# Altium project ADAS_ECU_revB.PrjPcb (part 3 of 3)

## Sheet LM74910H_PINOUT.SchDoc
size B; SheetNumber: 11; SheetTotal: 18
Used 2 times, as channels OR_0, OR_1. Parts and nets are listed once, with the designators drawn on the sheet.
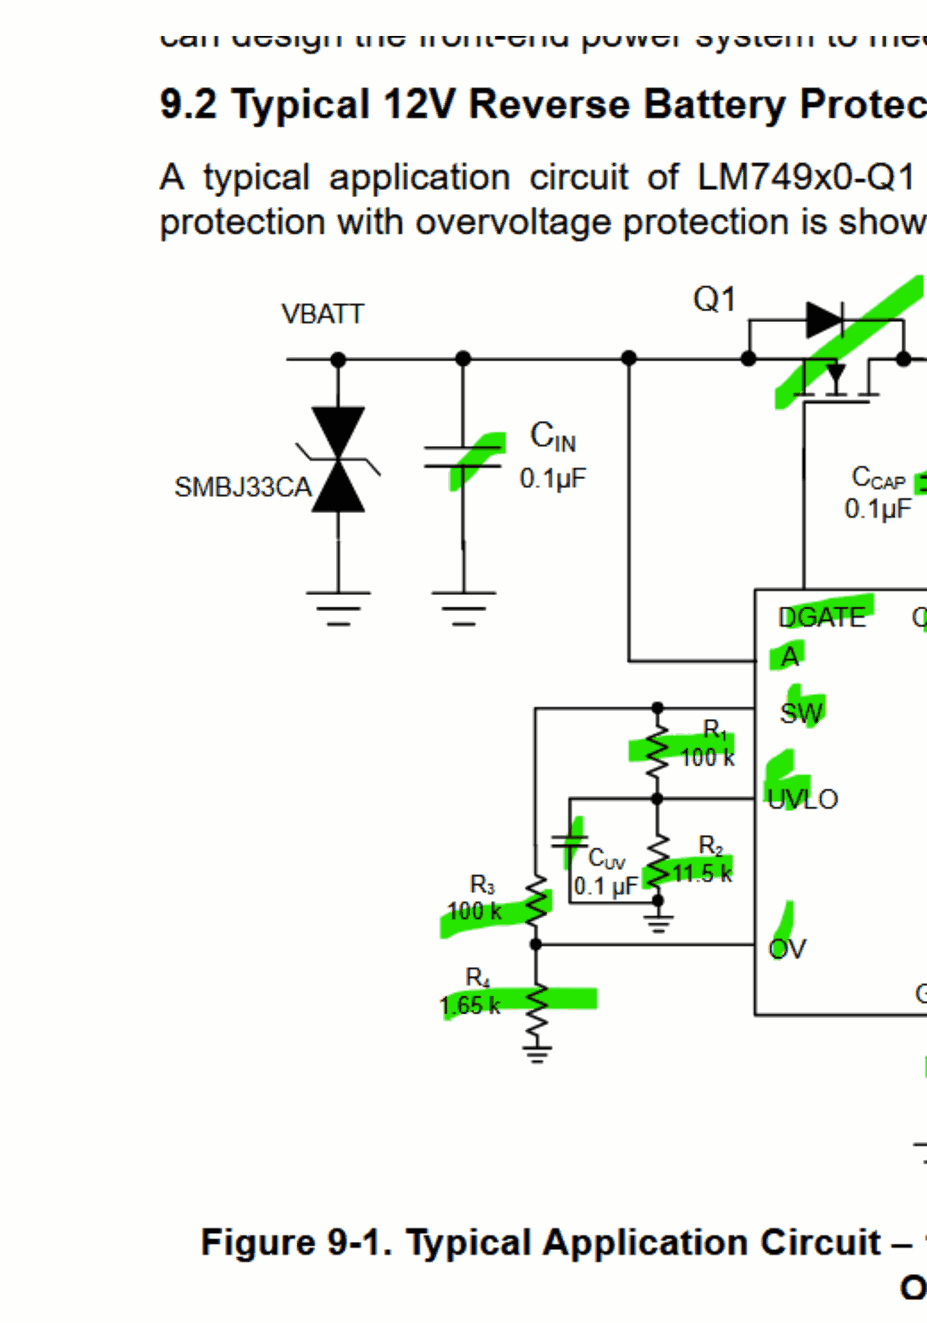
[diagram p23: LM74910H_PINOUT.SchDoc, top left]
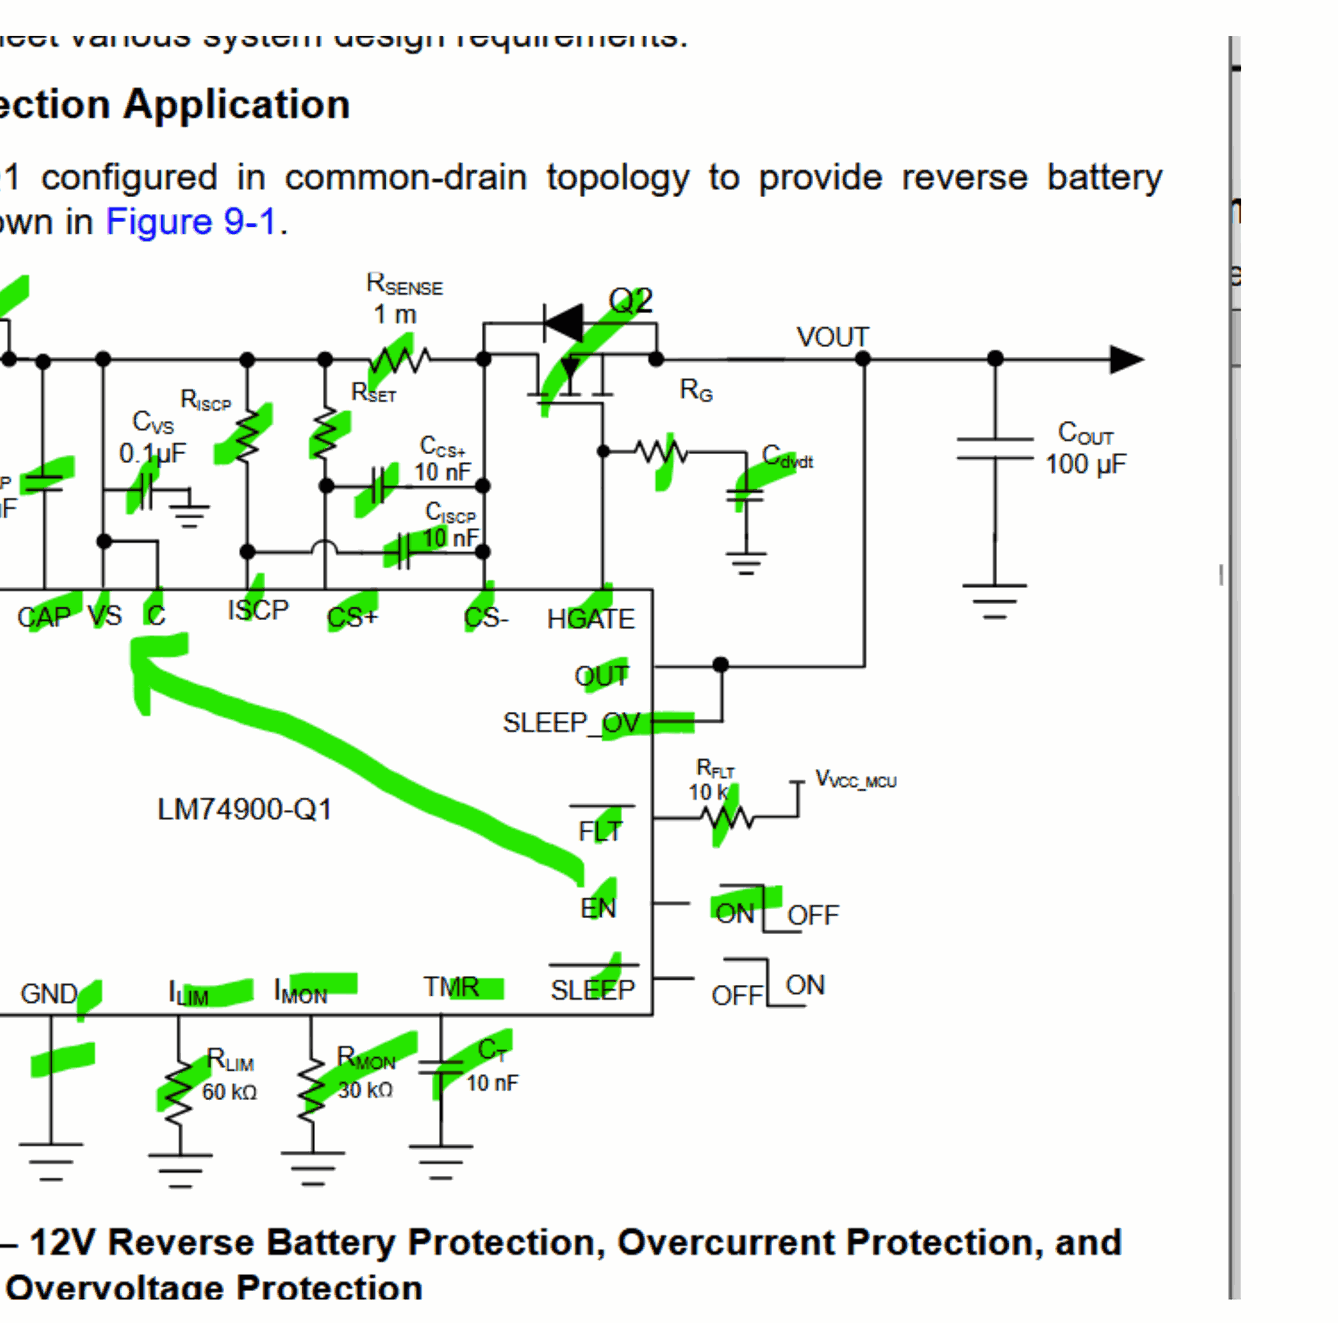
[diagram p24: LM74910H_PINOUT.SchDoc, top right]
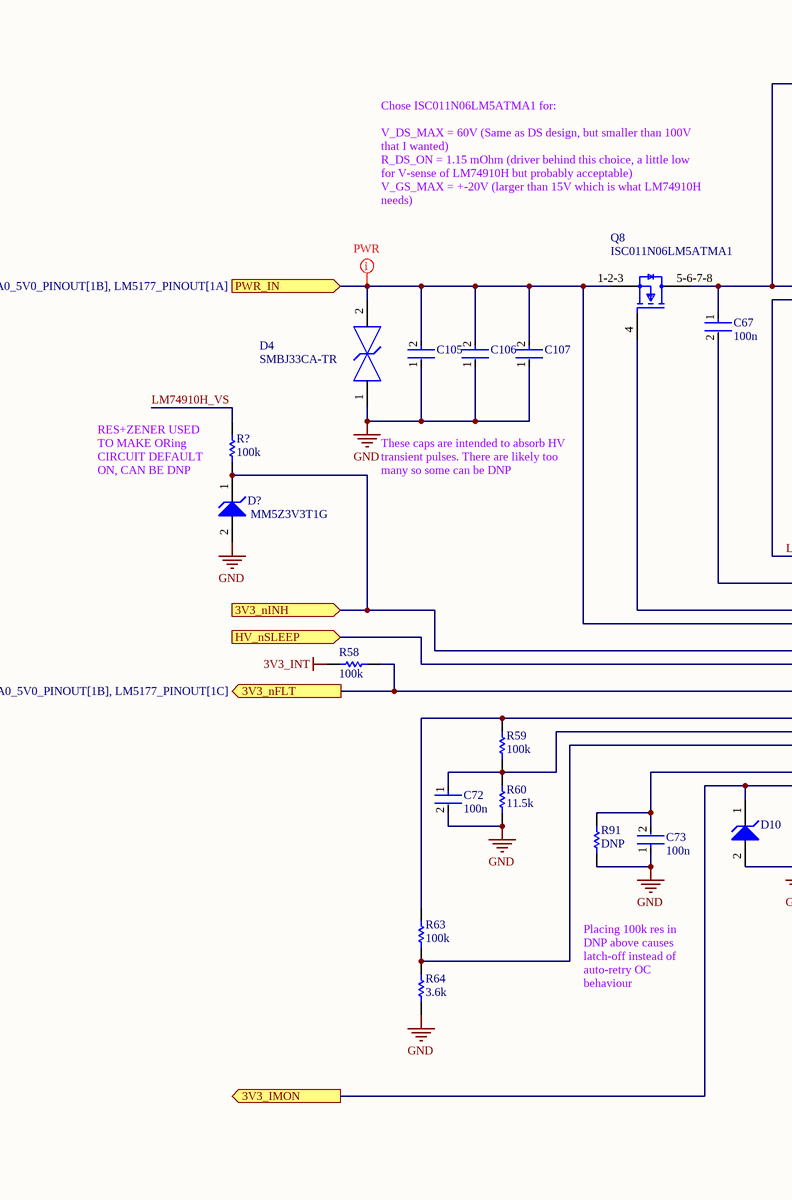
[diagram p25: LM74910H_PINOUT.SchDoc, bottom left]
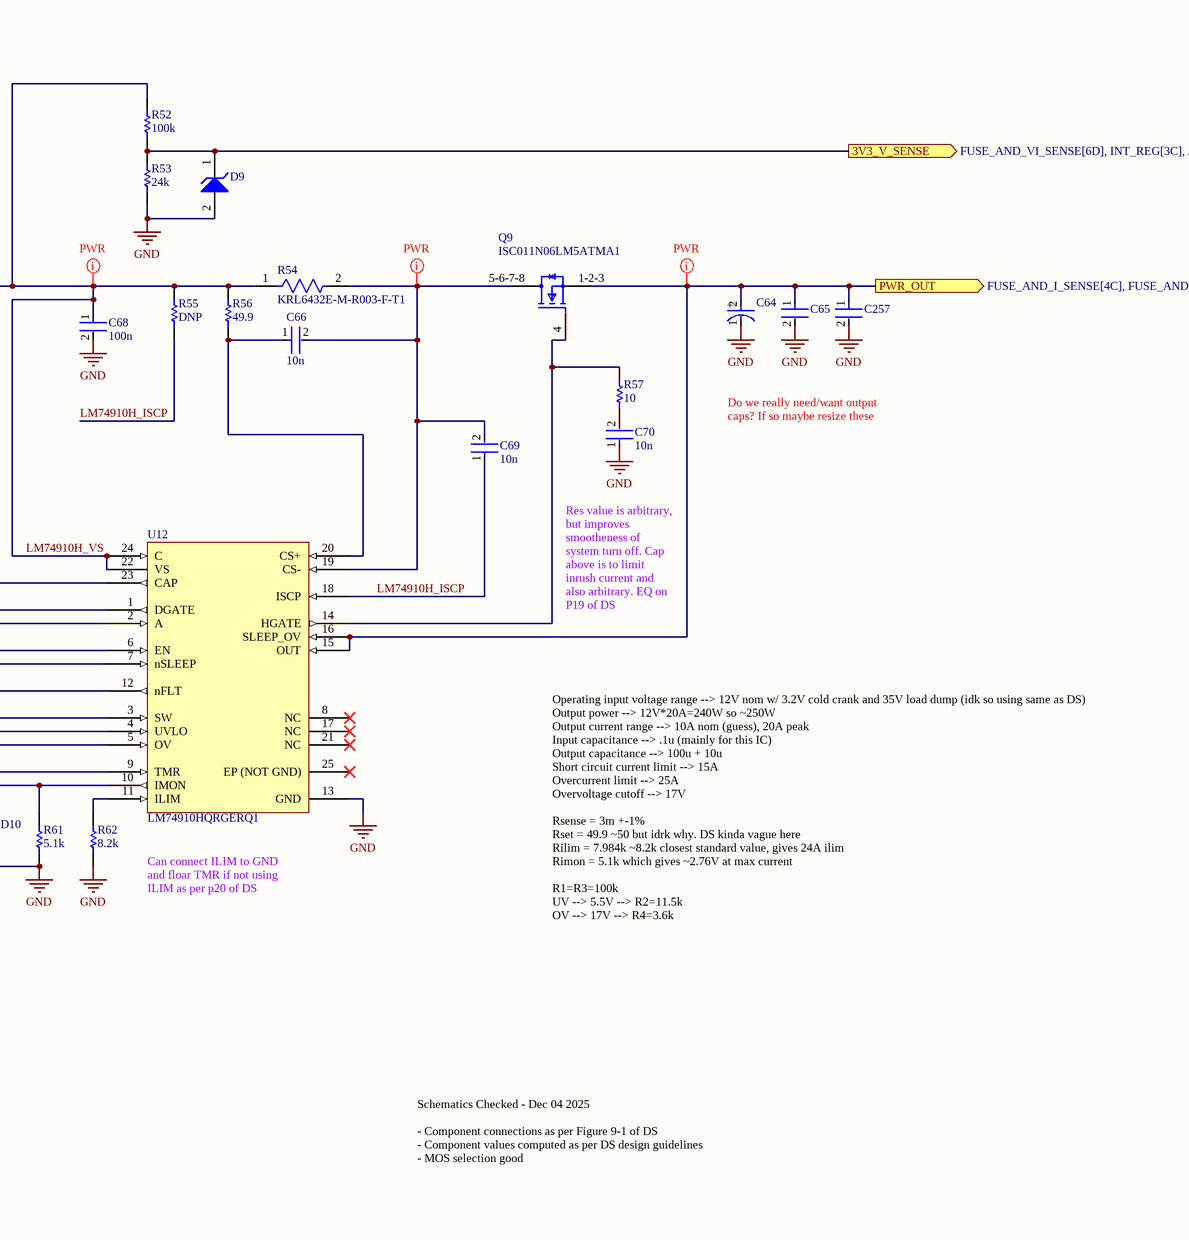
[diagram p26: LM74910H_PINOUT.SchDoc, bottom right]

### Parts
C64  EEE-FK1H100UR  [FP-FKC-MFG]  (value not drawn)
C65  12103D106KAT2A  [FP-1210-L_3_3_0_4-W_2_5_0-MFG]  (value not drawn)
C66  10n  [FP-0402-L_1_0_0_05-W_0_5-IPC_A]
C67  100n  [FP-0402-L_1_0_0_05-W_0_5-IPC_A]
C68  100n  [FP-0402-L_1_0_0_05-W_0_5-IPC_A]
C69  10n  [FP-0402-L_1_0_0_05-W_0_5-IPC_A]
C70  10n  [FP-0402-L_1_0_0_05-W_0_5-IPC_A]
C72  100n  [FP-0402-L_1_0_0_05-W_0_5-IPC_A]
C73  100n  [FP-0402-L_1_0_0_05-W_0_5-IPC_A]
C105  AC1210KKX7R0BB104  [FP-AC1210-0_85-MFG]  (value not drawn)
C106  AC1210KKX7R0BB104  [FP-AC1210-0_85-MFG]  (value not drawn)
C107  AC1210KKX7R0BB104  [FP-AC1210-0_85-MFG]  (value not drawn)
C257  12103D106KAT2A  [FP-1210-L_3_3_0_4-W_2_5_0-MFG]  (value not drawn)
D4  SMBJ33CA-TR  [FP-SMB-CA-MFG]
D9  DNP/MM5Z3V3T1G  [ONSC-SOD-523-2-502-01_V]  (value not drawn)
D10  DNP/MM5Z3V3T1G  [ONSC-SOD-523-2-502-01_V]  (value not drawn)
D?  MM5Z3V3T1G  [ONSC-SOD-523-2-502-01_V]
Q8  ISC011N06LM5ATMA1  [FP-PG-TDSON-8-MFG]
Q9  ISC011N06LM5ATMA1  [FP-PG-TDSON-8-MFG]
R52  100k  [R0603B]
R53  24k  [R0603B]
R54  KRL6432E-M-R003-F-T1  [FP-KRL6432E-MFG]
R55  DNP  [R0603B]
R56  49.9  [R0603B]
R57  10  [R0603B]
R58  100k  [R0603B]
R59  100k  [R0603B]
R60  11.5k  [R0603B]
R61  5.1k  [R0603B]
R62  8.2k  [R0603B]
R63  100k  [R0603B]
R64  3.6k  [R0603B]
R91  DNP  [R0603B]
R?  100k  [R0603B]
U12  LM74910HQRGERQ1  [QFN50P400X400X100_HS-25N]

### Ports
3V3_IMON (out), 3V3_nFLT (out, see LM704A0_3V3_PINOUT[1B], LM704A0_5V0_PINOUT[1B], LM5177_PINOUT[1C]), 3V3_nINH (in), 3V3_V_SENSE (out, see FUSE_AND_VI_SENSE[6D], INT_REG[3C], JETSON_PWR_MUX[5B], LM704A0_3V3_PINOUT[6B], LM704A0_5V0_PINOUT[6B], LM5177_PINOUT[6A]), HV_nSLEEP (in), PWR_IN (in, see FUSE_AND_I_SENSE[1B], FUSE_AND_VI_SENSE[1B], INT_REG[2A], LM704A0_3V3_PINOUT[2B], LM704A0_5V0_PINOUT[1B], LM5177_PINOUT[1A]), PWR_OUT (out, see FUSE_AND_I_SENSE[4C], FUSE_AND_VI_SENSE[6C], JETSON_PWR_MUX[5A], LM704A0_3V3_PINOUT[6B], LM704A0_5V0_PINOUT[6B], LM5177_PINOUT[6A])

### Nets
3V3_INT: R58.2
GND: C64.1(C) C65.2 C68.2 C70.1 C72.2 C73.1 C105.1 C106.1 C107.1 C257.2 D4.1 D9.2(A) D10.2(A) D?.2(A) R53.1 R60.1 R61.1 R62.1 R64.1 R91.1 U12.13(GND)
3V3_IMON: D10.1(K) R61.2 U12.10(IMON) ; port 3V3_IMON
3V3_nFLT: R58.1 U12.12(nFLT) ; port 3V3_nFLT
3V3_nINH: D?.1(K) R?.1 U12.6(EN) ; port 3V3_nINH
3V3_V_SENSE: D9.1(K) R52.1 R53.2 ; port 3V3_V_SENSE
HV_nSLEEP: U12.7(nSLEEP) ; port HV_nSLEEP
LM74910H_ISCP: C69.1 R55.1 U12.18(ISCP)
LM74910H_VS: C67.1 C68.1 Q8.5-6-7-8(D) R52.2 R54.1 R55.2 R56.2 R?.2 U12.22(VS) U12.24(C)
PWR_IN: C105.2 C106.2 C107.2 D4.2 Q8.1-2-3(S) U12.2(A) ; port PWR_IN
PWR_OUT: C64.2(A) C65.1 C257.1 Q9.1-2-3(S) U12.15(OUT) U12.16(SLEEP_OV) ; port PWR_OUT
NetC66_1: C66.1 R56.1 U12.20(CS+)
NetC66_2: C66.2 C69.2 Q9.5-6-7-8(D) R54.2 U12.19(CS-)
NetC67_2: C67.2 U12.23(CAP)
NetC70_2: C70.2 R57.1
NetC72_1: C72.1 R59.1 R60.2 U12.4(UVLO)
NetC73_2: C73.2 R91.2 U12.9(TMR)
NetQ8_4: Q8.4(G) U12.1(DGATE)
NetQ9_4: Q9.4(G) R57.2 U12.14(HGATE)
NetR59_2: R59.2 R63.2 U12.3(SW)
NetR62_2: R62.2 U12.11(ILIM)
NetR63_1: R63.1 R64.2 U12.5(OV)

Not connected (* = marked no-connect by the designer): U12 8(NC)* 17(NC)* 21(NC)* 25(EP_(NOT_GND))*

### Channels
OR_0: designators end in _OR_0; ports 3V3_IMON=3V3_CAR_VCC_I_SENSE 3V3_nFLT=3V3_CAR_OR_nFLT 3V3_nINH=NetD?_OR_0_1 3V3_V_SENSE=3V3_CAR_VCC_V_SENSE HV_nSLEEP=HV_PWR_EN PWR_IN=CAR_VCC PWR_OUT=PRE_VCC
OR_1: designators end in _OR_1; ports 3V3_IMON=3V3_CAR_APM_I_SENSE 3V3_nFLT=3V3_APM_OR_nFLT 3V3_nINH=NetD?_OR_1_1 3V3_V_SENSE=3V3_CAR_APM_V_SENSE HV_nSLEEP=HV_PWR_EN PWR_IN=APM_VCC PWR_OUT=PRE_VCC

### Layout directives
net class PWR: CAR_VCC, LM74910H_VS_OR_0, NetC66_OR_0_2, PRE_VCC

### Notes on the sheet
- Chose ISC011N06LM5ATMA1 for:
  V_DS_MAX = 60V (Same as DS design, but smaller than 100V that I wanted)
  R_DS_ON = 1.15 mOhm (driver behind this choice, a little low for V-sense of LM74910H but probably acceptable)
  V_GS_MAX = +-20V (larger than 15V which is what LM74910H needs)
- RES+ZENER USED TO MAKE ORing CIRCUIT DEFAULT ON, CAN BE DNP
- These caps are intended to absorb HV transient pulses. There are likely too many so some can be DNP
- Do we really need/want output caps? If so maybe resize these
- Res value is arbitrary, but improves smootheness of system turn off. Cap above is to limit inrush current and also arbitrary. EQ on P19 of DS
- Can connect ILIM to GND and floar TMR if not using ILIM as per p20 of DS
- Placing 100k res in DNP above causes latch-off instead of auto-retry OC behaviour
- Operating input voltage range --> 12V nom w/ 3.2V cold crank and 35V load dump (idk so using same as DS)
  Output power --> 12V*20A=240W so ~250W
  Output current range --> 10A nom (guess), 20A peak
  Input capacitance --> .1u (mainly for this IC)
  Output capacitance --> 100u + 10u
  Short circuit current limit --> 15A
  Overcurrent limit --> 25A
  Overvoltage cutoff --> 17V
  Rsense = 3m +-1%
  Rset = 49.9 ~50 but idrk why. DS kinda vague here
  Rilim = 7.984k ~8.2k closest standard value, gives 24A ilim
  Rimon = 5.1k which gives ~2.76V at max current
  R1=R3=100k
  UV --> 5.5V --> R2=11.5k
  OV --> 17V --> R4=3.6k
- Schematics Checked - Dec 04 2025
  - Component connections as per Figure 9-1 of DS
  - Component values computed as per DS design guidelines
  - MOS selection good
- (in symbol CMP-05427-000030-1) +

### Library data of the parts
C64 = CMP-05427-000030-1: CAP ALUM 10UF 20% 50V SMD; Impedance: 1.52R; Ripple Current (AC): 85mA; Life (Hours): 2000Hour; Leakage Current: 3uA; Dielectric Material: Aluminium; Length: 5.8mm; Voltage Rating: 50V; Radiation Hardening: No; Max Operating Temperature: 105°C; REACH SVHC: No SVHC; Tolerance: 20%; RoHS Compliant: Yes; Case/Package: Radial; Height: 5.8mm; Voltage: 50V; Diameter: 5mm; Number of Pins: 2; Ripple Current: 85mA; Series: FK; Lead Free: Lead Free; Width: 6.5mm; ESR (Equivalent Series Resistance): 1.52R; Package Quantity: 1000; Construction: Cylindrical; Voltage Rating (DC): 50V; Packaging: Tape and Reel; Height - Seated (Max): 0.228inch; Contact Plating: Tin; Capacitance: 10uF; Min Operating Temperature: -55°C; Termination: SMD/SMT; Material: Aluminium; Mount: Surface Mount
C65 C257 = CMP-2000-05477-2: General Purpose Ceramic Capacitor, 1210, 10uF, 10%, X5R, 15%, 25V; Lead Free: Lead Free; Max Operating Temperature: 85°C; REACH SVHC: No SVHC; Depth: 2.5mm; Packaging: Tape and Reel; Min Operating Temperature: -55°C; Height: 2.29mm; Construction: Flat; Case Code (Imperial): 1210; Radiation Hardening: No; Voltage: 25V; Case/Package: 1210; Series: -; Dielectric: X5R; Length: 3.2mm; Thickness: 0.11inch; Package Quantity: 1; Termination: SMD/SMT; Case Code (Metric): 3225; Voltage Rating (DC): 25V; Voltage Rating: 25V; Contact Plating: Tin; RoHS Compliant: Yes; Mount: Surface Mount; Width: 0.098inch; Capacitance: 10uF; Tolerance: 10%
C66-C70 C72 C73 = CMP-001-00058-1: LARGE PADS, 0402 CAP, CHANGE COMMENT TO MATCH REAL P/N; Capacitor Type: Ceramic; Min Operating Temperature: -55°C; Mounting Technology: Surface Mount; Pins: 2; Case/Package: 0402; RoHS Compliant: Yes; Max Operating Temperature: 85°C
C105-C107 = CMP-03422-000642-1: CAP CER 0.1UF 100V X7R 1210; Manufacturer: Yageo; Automotive Grade: Grade 1; Capacitance: 100 nF; Material: Ceramic; Value: 100 nF; Temperature Coefficient: 15%; Tolerance: 0.1; Automotive: Yes; ComponentLink2Description: Datasheet; Device Class L2: Capacitors; Height: 0.95mm; Manufacturer Part Number: AC1210KKX7R0BB104; Temperature: -55°C to +125°C; Voltage Rating: 100 V; Device Class L1: Passive Components; ComponentLink2URL: http://www.yageo.com/documents/recent/UPY-AC_NP0X7R_16V-to-630V_12.pdf; Lead Free: Yes; Category: Cap; Temperature Range High: +125°C; RoHS: TRUE; Digikey Description: CAP CER 0.1UF 100V X7R 1210; Temperature Range Low: -55°C; Octopart: https://octopart.com/ac1210kkx7r0bb104-yageo-78873719; Device Class L3: Ceramic Capacitors; Ipc Land Pattern Name: CAPC320250X85; Package: AC1210-0.85; Footprint Url: http://www.yageo.com/exep/pages/download/literatures/UPY-C_GEN_24.pdf; Temperature Characteristic: X7R
D4 = CMP-12225-000040-1: TVS DIODE 33V 69.7V SMB; Manufacturer: STMicroelectronics; Direction: Bidirectional; Peak Pulse Current: 11.8A; Peak Pulse Power: 600W; Clamping Voltage: 53.3V; Breakdown Voltage: 36.7V; Number Of Channels: 1; Standoff Height: 0.05mm; Max Junction Temp: +150°C; Lead Free: Yes; Device Class L1: Circuit Protection; Device Class L3: unset; Mouser Description: TVS Diodes - Transient Voltage Suppressors 600W 33V Bidirect; Device Class L2: TVS Diodes; Temperature Range High: +150°C; Temperature: -55°C to +150°C; Temperature Range Low: -55°C; Octopart: https://octopart.com/smbj33ca-tr-stmicroelectronics-347069; Manufacturer Part Number: SMBJ33CA-TR; Automotive: No; ComponentLink2URL: https://www.st.com/resource/en/datasheet/smbj.pdf; RoHS: TRUE; Package: SMB-CA; Category: Diode; ComponentLink2Description: Datasheet; Height: 2.65mm; Reverse Standoff Voltage: 33V; Digikey Description: TVS DIODE 33V 69.7V SMB
D9 D10 D? = CMP-1060-00750-1: Zener Voltage Regulator, 500 mW, 2-Pin SOD-523, Pb-Free, Tape and Reel; Manufacturer: On Semiconductor; P Max (W): 0.5; VZ Typ (V): 3.3; RoHS: Pb-Free; ComponentLink2Description: Datasheet; PackageReference: SOD-523-2-502-01; DatasheetVersion: Rev. 10; ComponentLink1Description: Manufacturer URL; PackageVersion: Rev. E, 09/2010; ComponentLink3URL: http://www.onsemi.com/pub_link/Collateral/502-01.PDF; ComponentLink2URL: http://www.onsemi.cn/pub_link/Collateral/MM5Z2V4T1-D.PDF; Mounting Technology: Surface Mount; PartNumber: MM5Z3V3T1G; Packing: Tape and Reel; PackageDescription: 2-Pin SOD, Body 1.2 x 0.8 mm; ComponentLink1URL: http://www.onsemi.com/; ComponentLink3Description: Package Specification
Q8 Q9 = CMP-32901-001049-1: TRENCH 40<-<100V PG-TDSON-8
R52 R53 R55-R64 R91 R? = CMP-009-00002-14: Resistor
R54 = CMP-00597-24927456-1: KRL6432E-M-R003-F-T1 Metal Foil Low Resistance Chip Resistor (long-side terminal), 2512, RoHS; Tolerance: 1%; Resistance: 3mΩ; Temperature Coefficient: 50ppm/°C; Power Rating: 3W; Height: 700µm; NexarPartId: 24927456; Termination: SMD/SMT; Case Code (Metric): 6432; Min Operating Temperature: -55°C; Length: 3.1mm; Weight: 40.511469mg; Width: 6.3mm; Lifecycle Status: Production; Max Operating Temperature: 155°C; Case Code (Imperial): 2512; Composition: Metal Foil; Case/Package: 2512; Max Thickness: 700µm; RoHS: Compliant
U12 = CMP-019-00057-1: Automotive ideal diode with circuit breaker, 200-kHz ACS, UV , OV protection and SLEEP mode 24-VQFN -40 to 125; Pins: 24; Case/Package: VQFN

## Sheet LM704A0_5V0_PINOUT.SchDoc
size C; SheetNumber: 9; SheetTotal: 19
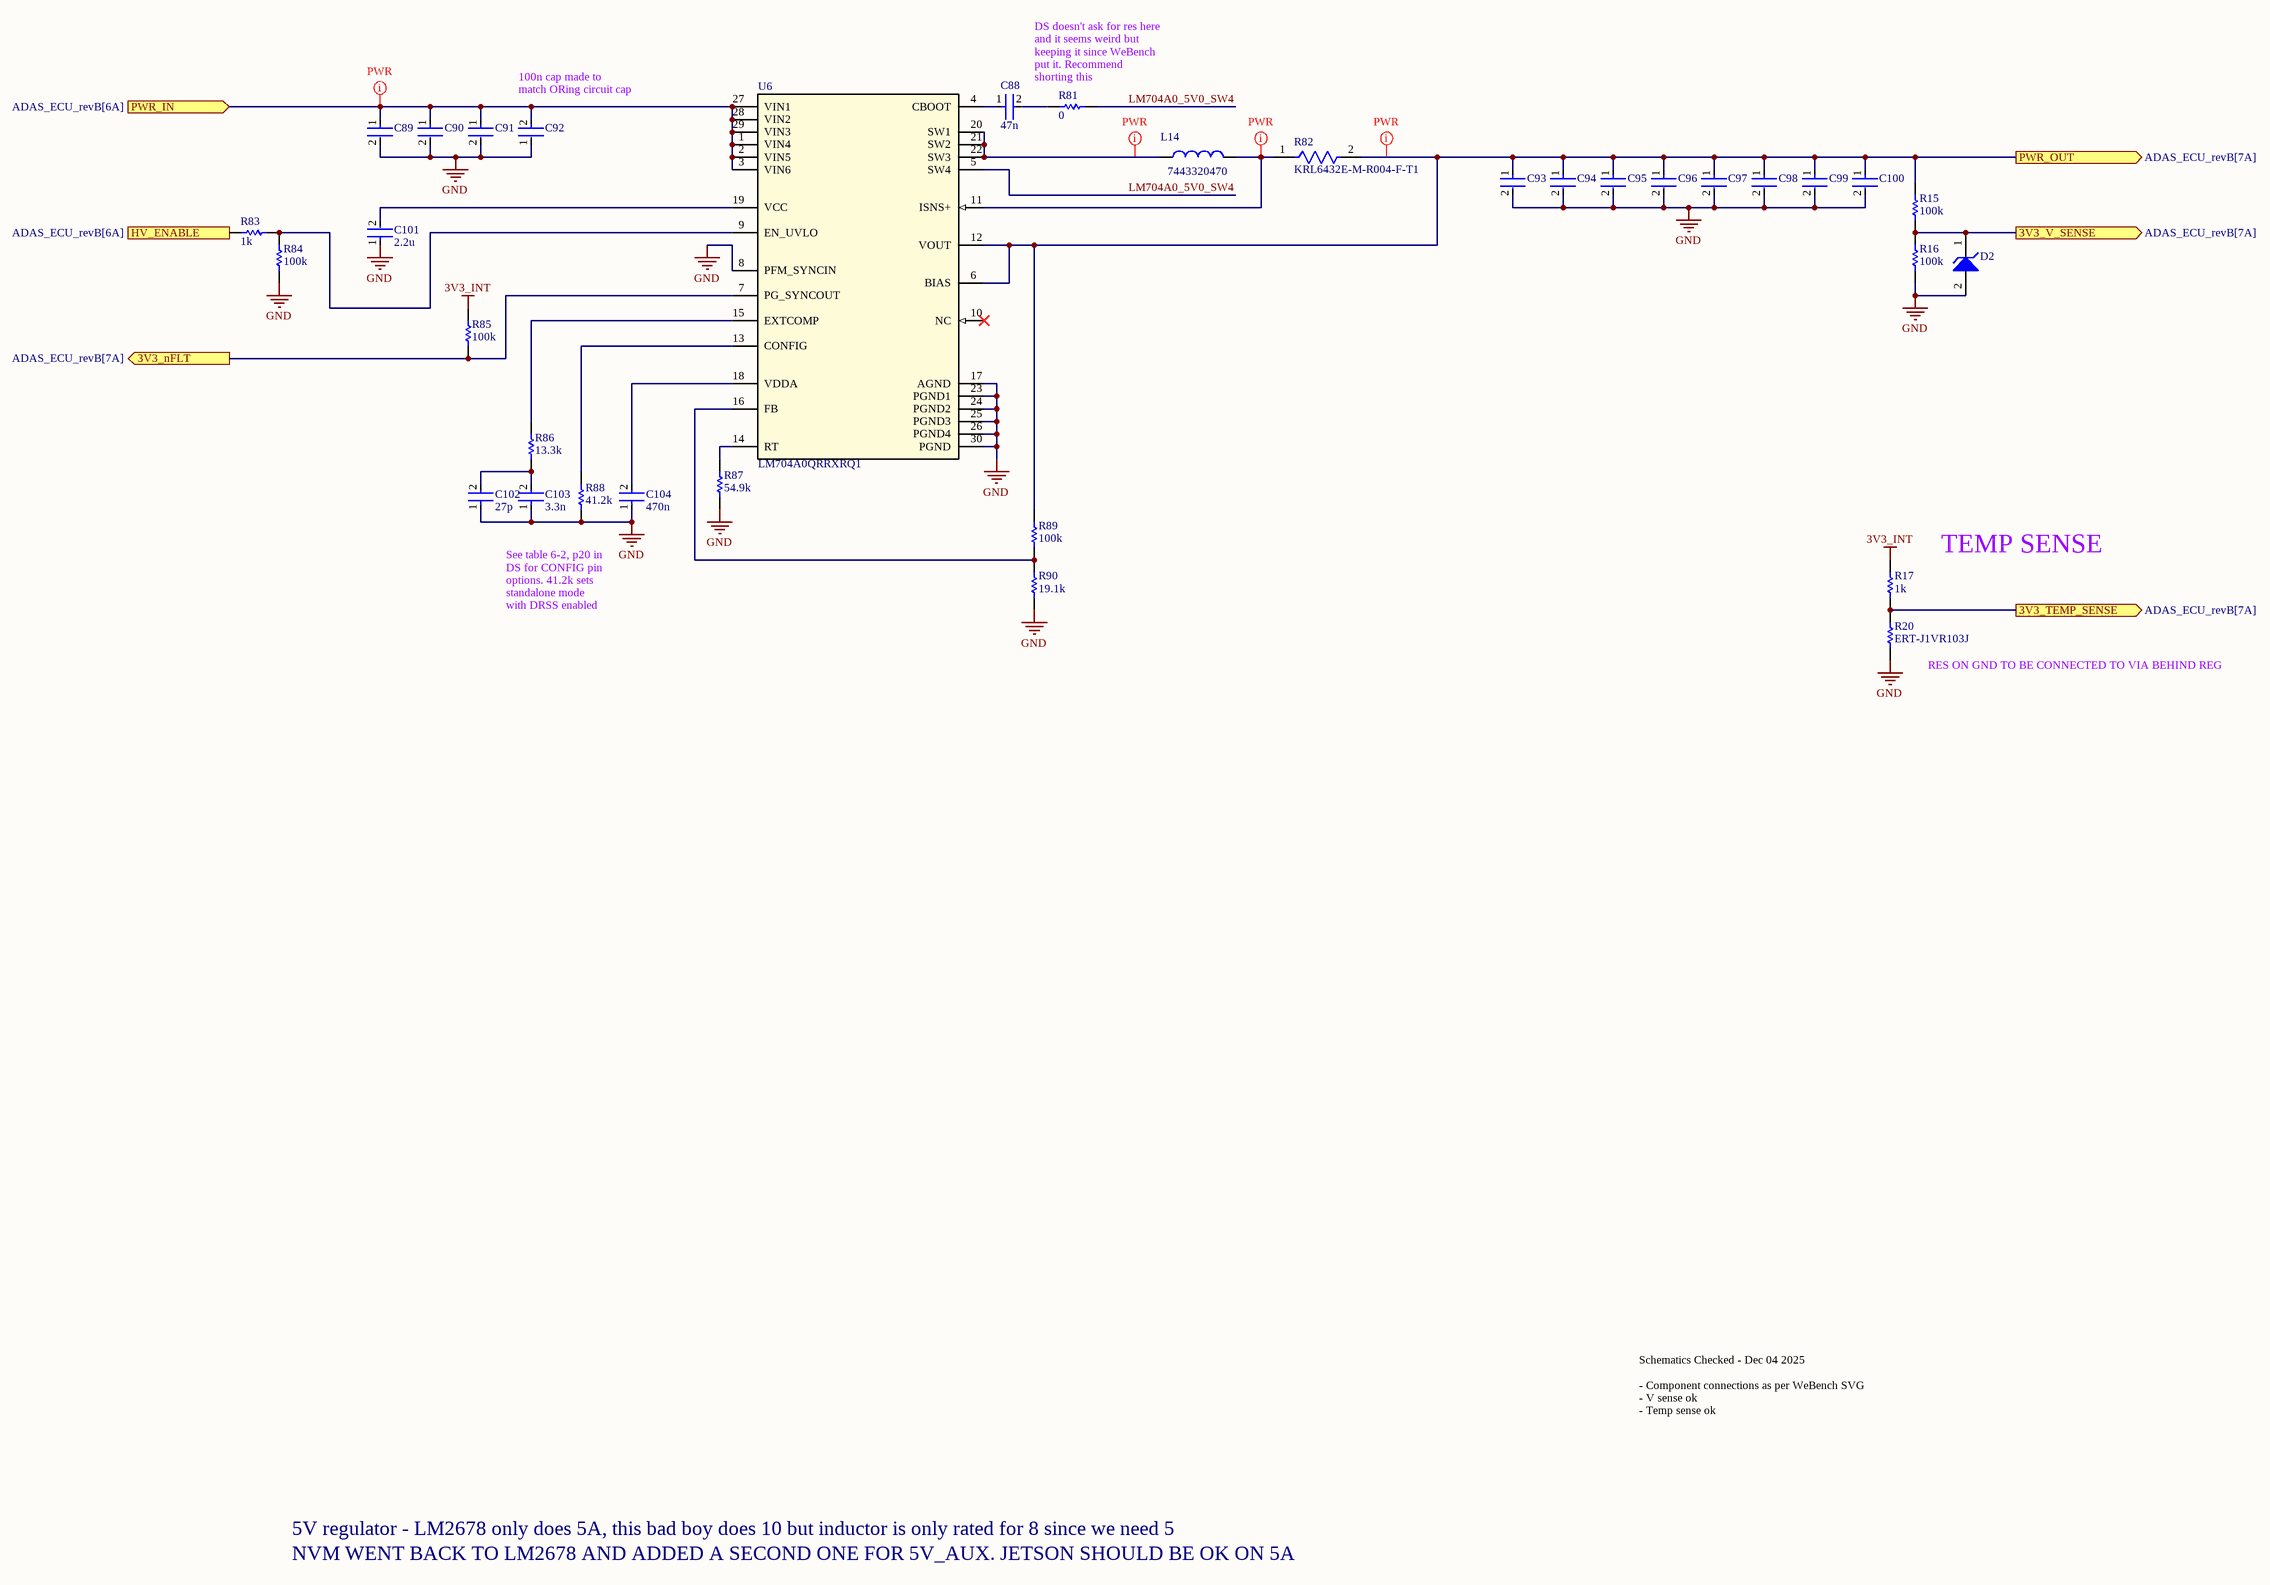
[diagram p27: LM704A0_5V0_PINOUT.SchDoc]

### Parts
C88  47n  [FP-0402-L_1_0_0_05-W_0_5-IPC_A]
C89  C3225X7R1H106M250AC  [FP-C3225-250-0_4-MFG]  (value not drawn)
C90  C3225X7R1H106M250AC  [FP-C3225-250-0_4-MFG]  (value not drawn)
C91  C3225X7R1H106M250AC  [FP-C3225-250-0_4-MFG]  (value not drawn)
C92  AC1210KKX7R0BB104  [FP-AC1210-0_85-MFG]  (value not drawn)
C93  GRM32ER61C476KE15L  [FP-GRM32E-0_3-0_2-IPC_C]  (value not drawn)
C94  GRM32ER61C476KE15L  [FP-GRM32E-0_3-0_2-IPC_C]  (value not drawn)
C95  GRM32ER61C476KE15L  [FP-GRM32E-0_3-0_2-IPC_C]  (value not drawn)
C96  GRM32ER61C476KE15L  [FP-GRM32E-0_3-0_2-IPC_C]  (value not drawn)
C97  GRM32ER61C476KE15L  [FP-GRM32E-0_3-0_2-IPC_C]  (value not drawn)
C98  GRM32ER61C476KE15L  [FP-GRM32E-0_3-0_2-IPC_C]  (value not drawn)
C99  GRM32ER61C476KE15L  [FP-GRM32E-0_3-0_2-IPC_C]  (value not drawn)
C100  GRM32ER61C476KE15L  [FP-GRM32E-0_3-0_2-IPC_C]  (value not drawn)
C101  2.2u  [FP-0402-L_1_0_0_05-W_0_5-IPC_A]
C102  27p  [FP-0402-L_1_0_0_05-W_0_5-IPC_A]
C103  3.3n  [FP-0402-L_1_0_0_05-W_0_5-IPC_A]
C104  470n  [FP-0402-L_1_0_0_05-W_0_5-IPC_A]
D2  MM5Z3V3T1G  [ONSC-SOD-523-2-502-01_V]  (value not drawn)
L14  7443320470  [WE-HCC_1210]
R15  100k  [R0603B]
R16  100k  [R0603B]
R17  1k  [R0603B]
R20  ERT-J1VR103J  [RESC1608X90X30ML15T20]
R81  0  [R0603B]
R82  KRL6432E-M-R004-F-T1  [FP-KRL6432E-MFG]
R83  1k  [R0603B]
R84  100k  [R0603B]
R85  100k  [R0603B]
R86  13.3k  [R0603B]
R87  54.9k  [R0603B]
R88  41.2k  [R0603B]
R89  100k  [R0603B]
R90  19.1k  [R0603B]
U6  LM704A0QRRXRQ1  [LM704A0QRRXRQ1-Footprint-1]

### Ports
3V3_nFLT (out, see ADAS_ECU_revB[7A]), 3V3_TEMP_SENSE (out, see ADAS_ECU_revB[7A]), 3V3_V_SENSE (out, see ADAS_ECU_revB[7A]), HV_ENABLE (in, see ADAS_ECU_revB[6A]), PWR_IN (in, see ADAS_ECU_revB[6A]), PWR_OUT (out, see ADAS_ECU_revB[7A])

### Nets
3V3_INT: R17.1 R85.2
5V0_MAIN: C93.1 C94.1 C95.1 C96.1 C97.1 C98.1 C99.1 C100.1 R15.1 R82.2 R89.1 U6.6(BIAS) U6.12(VOUT) ; port PWR_OUT
GND: C89.2 C90.2 C91.2 C92.1 C93.2 C94.2 C95.2 C96.2 C97.2 C98.2 C99.2 C100.2 C101.1 C102.1 C103.1 C104.1 D2.2(A) R16.2 R20.1 R84.1 R87.2 R88.2 R90.2 U6.8(PFM_SYNCIN) U6.17(AGND) U6.23(PGND1) U6.24(PGND2) U6.25(PGND3) U6.26(PGND4) U6.30(PGND)
3V3_5V0_MAIN_ENABLE: R83.2 ; port HV_ENABLE
3V3_5V0_MAIN_nFLT: R85.1 U6.7(PG_SYNCOUT) ; port 3V3_nFLT
3V3_5V0_MAIN_T_SENSE: R17.2 R20.2 ; port 3V3_TEMP_SENSE
3V3_5V0_MAIN_V_SENSE: D2.1(K) R15.2 R16.1 ; port 3V3_V_SENSE
5V0_MAIN_PWR_IN: C89.1 C90.1 C91.1 C92.2 U6.1(VIN4) U6.2(VIN5) U6.3(VIN6) U6.27(VIN1) U6.28(VIN2) U6.29(VIN3) ; port PWR_IN
LM704A0_5V0_SW4: R81.2 U6.5(SW4)
NetC88_1: C88.1 U6.4(CBOOT)
NetC88_2: C88.2 R81.1
NetC101_2: C101.2 U6.19(VCC)
NetC102_2: C102.2 C103.2 R86.1
NetC104_2: C104.2 U6.18(VDDA)
NetL14_1: L14.1 U6.20(SW1) U6.21(SW2) U6.22(SW3)
NetL14_2: L14.2 R82.1 U6.11(ISNS+)
NetR83_1: R83.1 R84.2 U6.9(EN_UVLO)
NetR86_2: R86.2 U6.15(EXTCOMP)
NetR87_1: R87.1 U6.14(RT)
NetR88_1: R88.1 U6.13(CONFIG)
NetR89_2: R89.2 R90.1 U6.16(FB)

Not connected (* = marked no-connect by the designer): U6 10(NC)*

### Layout directives
net class PWR: 5V0_MAIN, 5V0_MAIN_PWR_IN, NetL14_1, NetL14_2

### Notes on the sheet
- 100n cap made to match ORing circuit cap
- DS doesn't ask for res here and it seems weird but keeping it since WeBench put it. Recommend shorting this
- TEMP SENSE
- See table 6-2, p20 in DS for CONFIG pin options. 41.2k sets standalone mode with DRSS enabled
- (near R20) RES ON GND TO BE CONNECTED TO VIA BEHIND REG
- Schematics Checked - Dec 04 2025
  - Component connections as per WeBench SVG
  - V sense ok
  - Temp sense ok
- 5V regulator - LM2678 only does 5A, this bad boy does 10 but inductor is only rated for 8 since we need 5
- NVM WENT BACK TO LM2678 AND ADDED A SECOND ONE FOR 5V_AUX. JETSON SHOULD BE OK ON 5A

### Library data of the parts
C88 C101-C104 = CMP-001-00058-1: as C66 on sheet LM74910H_PINOUT; Min Operating Temperature: -55°C; Mounting Technology: Surface Mount; Pins: 2; Case/Package: 0402; RoHS Compliant: Yes; Max Operating Temperature: 85°C
C89-C91 = CMP-08246-002653-1: Multilayer Ceramic Capacitors 10uF ±20% 50V X7R SMD 1210; Width: 0.098inch; Package Quantity: 1000; Height: 2.5mm; Dielectric Material: Ceramic; Voltage Rating: 50V; Series: C; Capacitance: 10uF; Tolerance: 20%; Weight: 0.000564oz; Case/Package: 1210; Case Code (Imperial): 1210; Dielectric: X7R; Case Code (Metric): 3225; REACH SVHC: No SVHC; Packaging: Tape and Reel; Length: 0.126inch; Termination: SMD/SMT; Min Operating Temperature: -55°C; Voltage Rating (DC): 50V; Lead Free: Lead Free; Max Operating Temperature: 125°C; Thickness: 0.11inch; Mount: Surface Mount
C92 = CMP-03422-000642-1: as C105 on sheet LM74910H_PINOUT; Automotive: Yes; ComponentLink2Description: Datasheet; Device Class L2: Capacitors; Height: 0.95mm; Manufacturer Part Number: AC1210KKX7R0BB104; Temperature: -55°C to +125°C; Voltage Rating: 100 V; Device Class L1: Passive Components; ComponentLink2URL: http://www.yageo.com/documents/recent/UPY-AC_NP0X7R_16V-to-630V_12.pdf; Lead Free: Yes; Category: Cap; Temperature Range High: +125°C; RoHS: TRUE; Digikey Description: CAP CER 0.1UF 100V X7R 1210; Temperature Range Low: -55°C; Octopart: https://octopart.com/ac1210kkx7r0bb104-yageo-78873719; Device Class L3: Ceramic Capacitors; Ipc Land Pattern Name: CAPC320250X85; Package: AC1210-0.85; Footprint Url: http://www.yageo.com/exep/pages/download/literatures/UPY-C_GEN_24.pdf; Temperature Characteristic: X7R
C93-C100 = CMP-2000-06362-2: CAP CER 47UF 16V X5R 1210; Tolerance: 10%; Material: Ceramic; Case Code (Metric): 3225; RoHS Compliant: Yes; Min Operating Temperature: -55°C; Radiation Hardening: No; Voltage: 16V; Package Quantity: 1; Case Code (Imperial): 1210; REACH SVHC: No SVHC; Capacitance: 47uF; Voltage Rating (DC): 16V; Dielectric: X5R; Case/Package: 1210; Length: 3.2mm; Voltage Rating: 16V; Packaging: Cut Tape; Width: 0.098inch; Number of Pins: 2; Lead Free: Lead Free; Height: 2.5mm; Mount: Surface Mount; Termination: SMD/SMT; Max Operating Temperature: 85°C; Thickness: 0.106inch; Depth: 2.5mm
D2 = CMP-1060-00750-1: as D9 on sheet LM74910H_PINOUT; RoHS: Pb-Free; ComponentLink2Description: Datasheet; PackageReference: SOD-523-2-502-01; DatasheetVersion: Rev. 10; ComponentLink1Description: Manufacturer URL; PackageVersion: Rev. E, 09/2010; ComponentLink3URL: http://www.onsemi.com/pub_link/Collateral/502-01.PDF; ComponentLink2URL: http://www.onsemi.cn/pub_link/Collateral/MM5Z2V4T1-D.PDF; Mounting Technology: Surface Mount; PartNumber: MM5Z3V3T1G; Packing: Tape and Reel; PackageDescription: 2-Pin SOD, Body 1.2 x 0.8 mm; ComponentLink1URL: http://www.onsemi.com/; ComponentLink3Description: Package Specification
L14 = CMP-0226-00121-3: We-hcc Series, Shielded Wire-wound SMD Inductor With Ferrite Core, 4.7 Uh; Inductance Tolerance: 20%; Self Resonant Frequency: 43MHz; Saturation Current: 15.6A; Current Rating: 15.5A; Inductance: 4.7µH; DC Resistance (DCR): 7.25mΩ; Width: 11.4mm; Core Material: Ferrite; Number of Pins: 2; Material: Ferrite; RoHS: Compliant; Length: 12.1mm; Max Operating Temperature: 125°C; Ambient Temperature Range Low: -40°C; Min Operating Temperature: -40°C; Height: 9.5mm; Ambient Temperature Range High: 75°C
R15-R17 R81 R83-R90 = CMP-009-00002-14: Resistor
  R15 R16: Value: 100k
  R17: Value: 1k
R20 = CMP-2000-00869-1: Manufacturer: Panasonic; Part Number: ERT-J1VR103J
R82 = CMP-00597-24927457-1: KRL6432E-M-R004-F-T1 Metal Foil Low Resistance Chip Resistor (long-side terminal), 2512, RoHS; Power Rating: 3W; Temperature Coefficient: 50ppm/°C; Tolerance: 1%; Resistance: 4mΩ; Length: 3.1mm; Composition: Metal Foil; Termination: SMD/SMT; Max Operating Temperature: 155°C; Case Code (Imperial): 2512; NexarPartId: 24927457; Width: 6.3mm; Max Power Dissipation: 3W; Case Code (Metric): 6432; Min Operating Temperature: -55°C; Packaging: Digi-Reel®; Max Thickness: 700µm; Lifecycle Status: Production; Height: 700µm; Weight: 40.511469mg; Case/Package: 2512; RoHS: Compliant; Number of Terminations: 2
U6 = CMP-019-00058-1: Automotive, High-density, 4.5V to 45V input, 10A low-EMI synchronous DC/DC step-down converter 29-VQFN -40 to 150; Case/Package: VQFN; Pins: 29

## Sheet LM704A0_3V3_PINOUT.SchDoc
size C; SheetNumber: 8; SheetTotal: 19
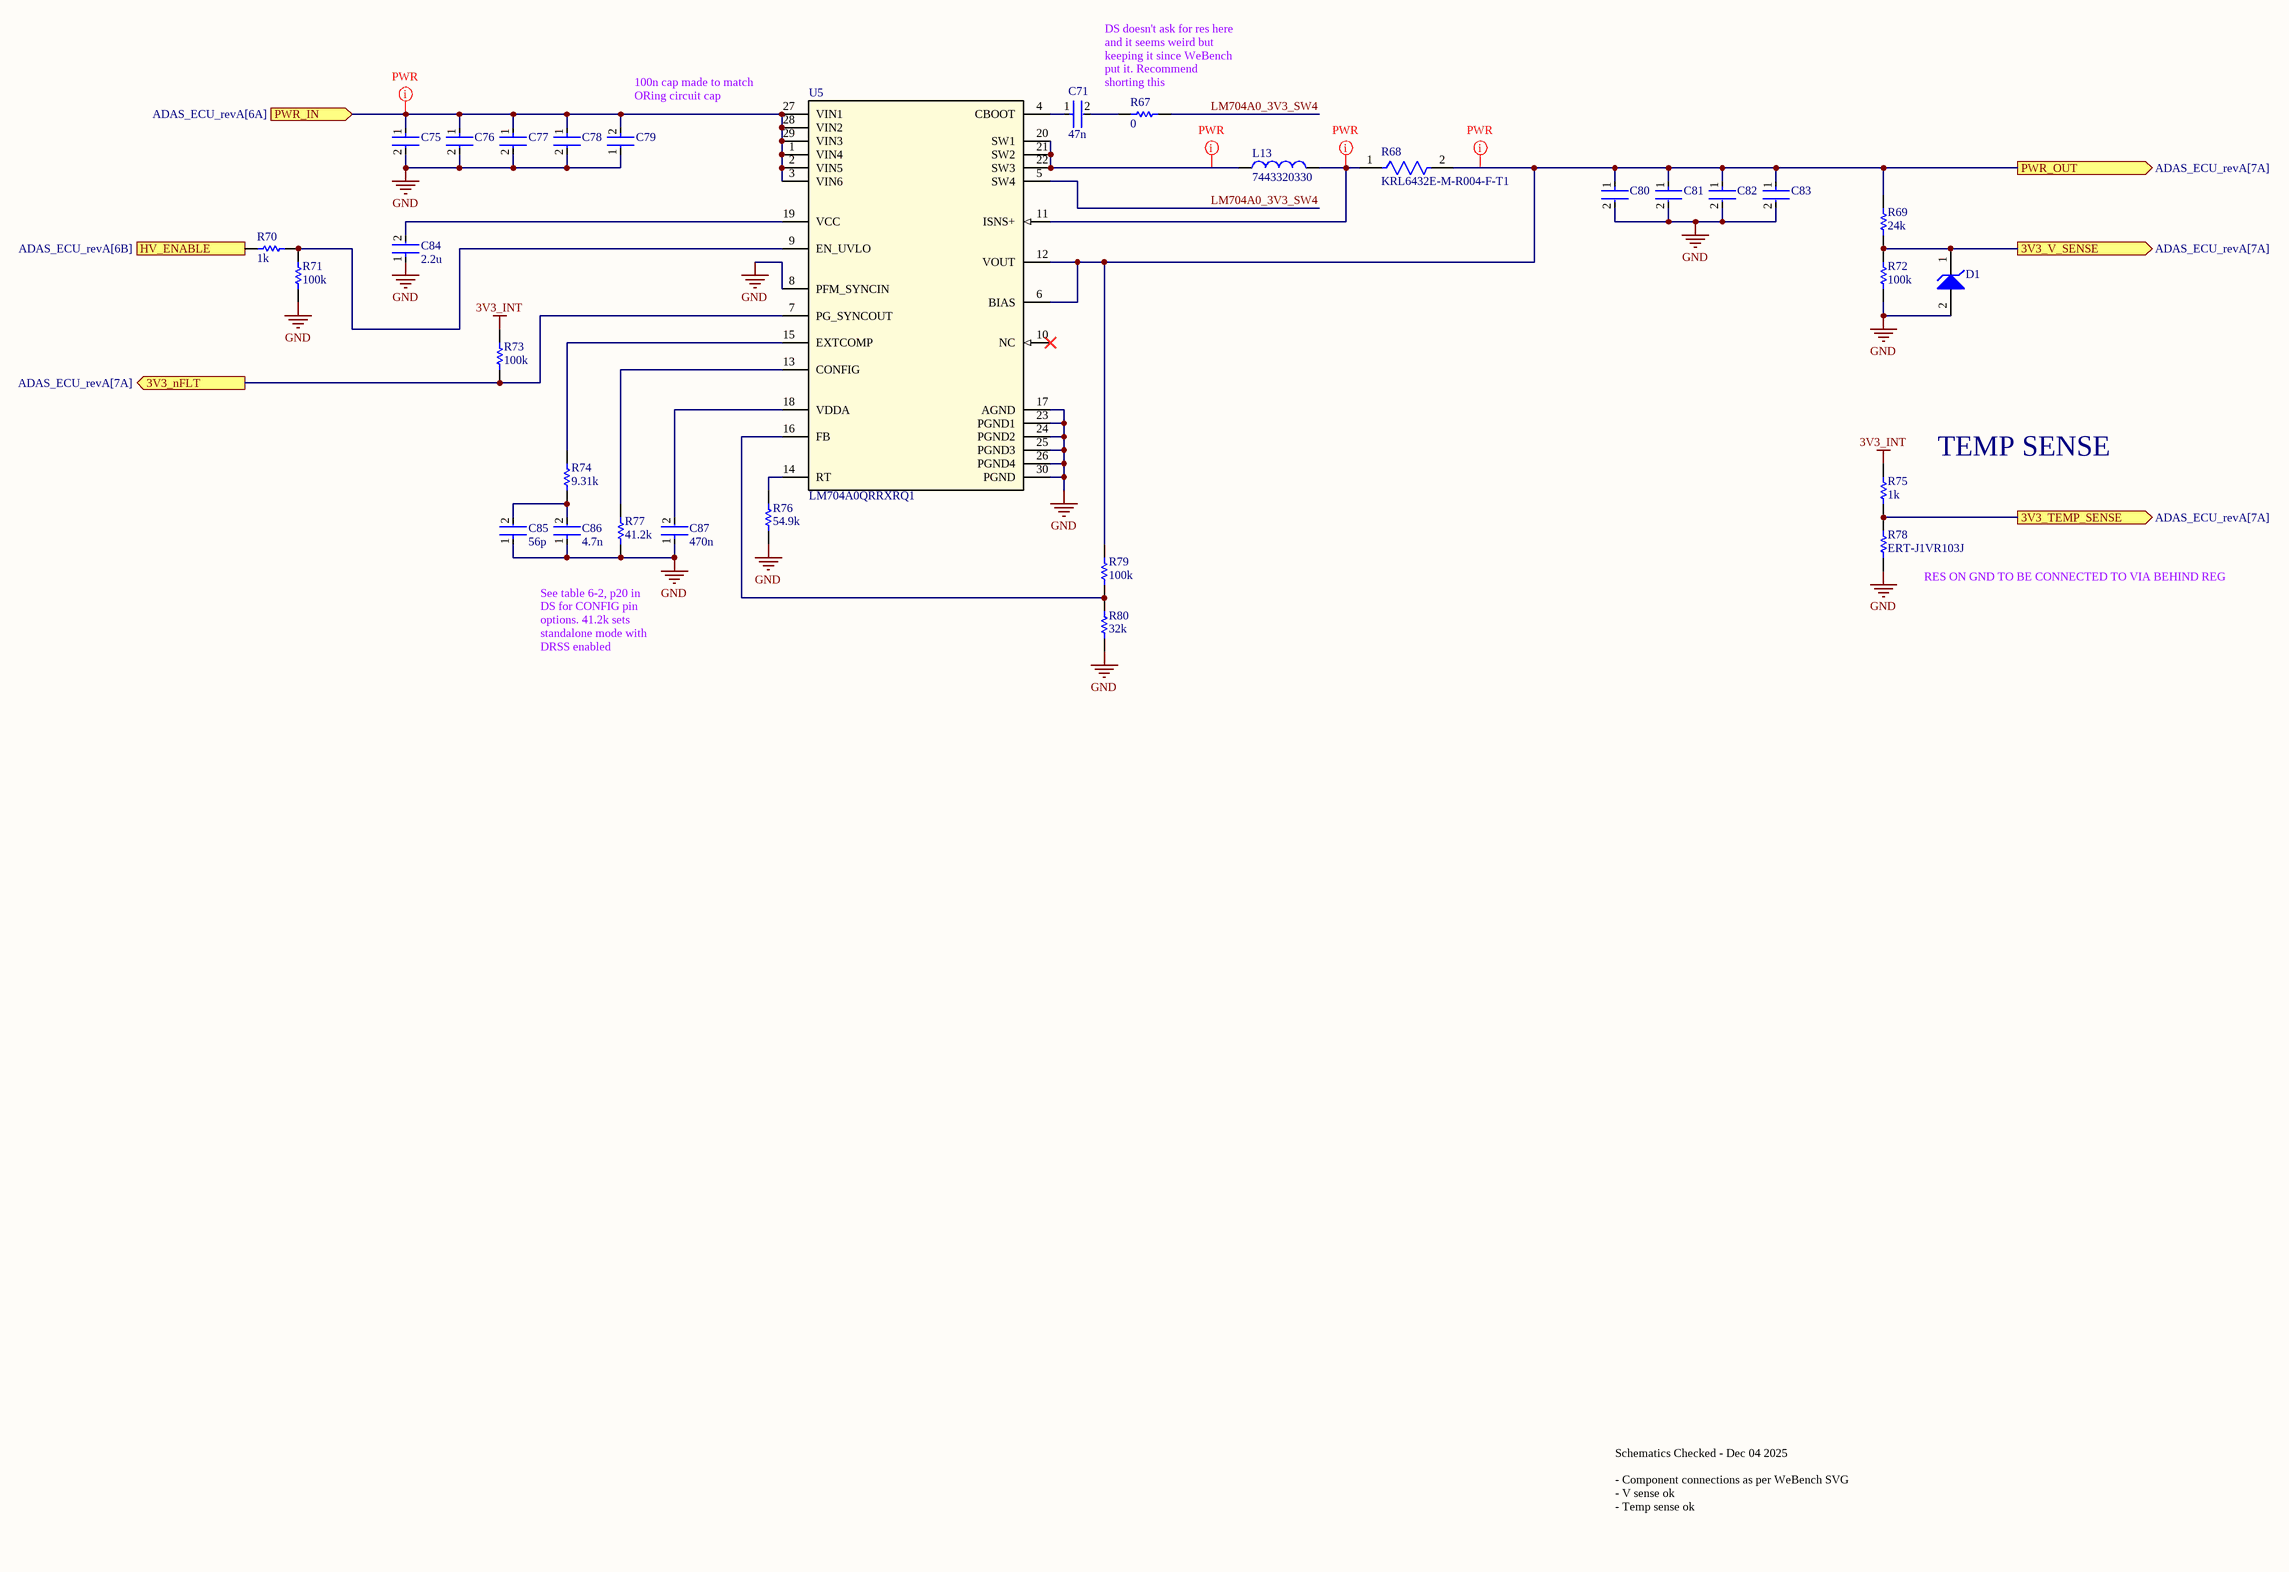
[diagram p28: LM704A0_3V3_PINOUT.SchDoc]

### Parts
C71  47n  [FP-0402-L_1_0_0_05-W_0_5-IPC_A]
C75  C3225X7R1H106M250AC  [FP-C3225-250-0_4-MFG]  (value not drawn)
C76  C3225X7R1H106M250AC  [FP-C3225-250-0_4-MFG]  (value not drawn)
C77  C3225X7R1H106M250AC  [FP-C3225-250-0_4-MFG]  (value not drawn)
C78  C3225X7R1H106M250AC  [FP-C3225-250-0_4-MFG]  (value not drawn)
C79  AC1210KKX7R0BB104  [FP-AC1210-0_85-MFG]  (value not drawn)
C80  GRM32EC80J107ME20L  [FP-GRM32E-0_3-0_2-IPC_C]  (value not drawn)
C81  GRM32EC80J107ME20L  [FP-GRM32E-0_3-0_2-IPC_C]  (value not drawn)
C82  GRM32EC80J107ME20L  [FP-GRM32E-0_3-0_2-IPC_C]  (value not drawn)
C83  GRM32EC80J107ME20L  [FP-GRM32E-0_3-0_2-IPC_C]  (value not drawn)
C84  2.2u  [FP-0402-L_1_0_0_05-W_0_5-IPC_A]
C85  56p  [FP-0402-L_1_0_0_05-W_0_5-IPC_A]
C86  4.7n  [FP-0402-L_1_0_0_05-W_0_5-IPC_A]
C87  470n  [FP-0402-L_1_0_0_05-W_0_5-IPC_A]
D1  DNP/MM5Z3V3T1G  [ONSC-SOD-523-2-502-01_V]  (value not drawn)
L13  7443320330  [WE-HCC_1210]
R67  0  [R0603B]
R68  KRL6432E-M-R004-F-T1  [FP-KRL6432E-MFG]
R69  24k  [R0603B]
R70  1k  [R0603B]
R71  100k  [R0603B]
R72  100k  [R0603B]
R73  100k  [R0603B]
R74  9.31k  [R0603B]
R75  1k  [R0603B]
R76  54.9k  [R0603B]
R77  41.2k  [R0603B]
R78  ERT-J1VR103J  [RESC1608X90X30ML15T20]
R79  100k  [R0603B]
R80  32k  [R0603B]
U5  LM704A0QRRXRQ1  [LM704A0QRRXRQ1-Footprint-1]

### Ports
3V3_nFLT (out, see ADAS_ECU_revA[7A]), 3V3_TEMP_SENSE (out, see ADAS_ECU_revA[7A]), 3V3_V_SENSE (out, see ADAS_ECU_revA[7A]), HV_ENABLE (in, see ADAS_ECU_revA[6B]), PWR_IN (in, see ADAS_ECU_revA[6A]), PWR_OUT (out, see ADAS_ECU_revA[7A])

### Nets
3V3_INT: R73.2 R75.1
3V3_MAIN: C80.1 C81.1 C82.1 C83.1 R68.2 R69.1 R79.1 U5.6(BIAS) U5.12(VOUT) ; port PWR_OUT
GND: C75.2 C76.2 C77.2 C78.2 C79.1 C80.2 C81.2 C82.2 C83.2 C84.1 C85.1 C86.1 C87.1 D1.2(A) R71.1 R72.2 R76.2 R77.2 R78.1 R80.2 U5.8(PFM_SYNCIN) U5.17(AGND) U5.23(PGND1) U5.24(PGND2) U5.25(PGND3) U5.26(PGND4) U5.30(PGND)
3V3_3V3_MAIN_ENABLE: R70.2 ; port HV_ENABLE
3V3_3V3_MAIN_nFLT: R73.1 U5.7(PG_SYNCOUT) ; port 3V3_nFLT
3V3_3V3_MAIN_T_SENSE: R75.2 R78.2 ; port 3V3_TEMP_SENSE
3V3_3V3_MAIN_V_SENSE: D1.1(K) R69.2 R72.1 ; port 3V3_V_SENSE
3V3_MAIN_PWR_IN: C75.1 C76.1 C77.1 C78.1 C79.2 U5.1(VIN4) U5.2(VIN5) U5.3(VIN6) U5.27(VIN1) U5.28(VIN2) U5.29(VIN3) ; port PWR_IN
LM704A0_3V3_SW4: R67.2 U5.5(SW4)
NetC71_1: C71.1 U5.4(CBOOT)
NetC71_2: C71.2 R67.1
NetC84_2: C84.2 U5.19(VCC)
NetC85_2: C85.2 C86.2 R74.2
NetC87_2: C87.2 U5.18(VDDA)
NetL13_1: L13.1 U5.20(SW1) U5.21(SW2) U5.22(SW3)
NetL13_2: L13.2 R68.1 U5.11(ISNS+)
NetR70_1: R70.1 R71.2 U5.9(EN_UVLO)
NetR74_1: R74.1 U5.15(EXTCOMP)
NetR76_1: R76.1 U5.14(RT)
NetR77_1: R77.1 U5.13(CONFIG)
NetR79_2: R79.2 R80.1 U5.16(FB)

Not connected (* = marked no-connect by the designer): U5 10(NC)*

### Layout directives
net class PWR: 3V3_MAIN, 3V3_MAIN_PWR_IN, NetL13_1, NetL13_2

### Notes on the sheet
- 100n cap made to match ORing circuit cap
- DS doesn't ask for res here and it seems weird but keeping it since WeBench put it. Recommend shorting this
- TEMP SENSE
- (near R78) RES ON GND TO BE CONNECTED TO VIA BEHIND REG
- See table 6-2, p20 in DS for CONFIG pin options. 41.2k sets standalone mode with DRSS enabled
- Schematics Checked - Dec 04 2025
  - Component connections as per WeBench SVG
  - V sense ok
  - Temp sense ok

### Library data of the parts
C71 C84-C87 = CMP-001-00058-1: as C66 on sheet LM74910H_PINOUT; Min Operating Temperature: -55°C; Mounting Technology: Surface Mount; Pins: 2; Case/Package: 0402; RoHS Compliant: Yes; Max Operating Temperature: 85°C
C75-C78 = CMP-08246-002653-1: as C89 on sheet LM704A0_5V0_PINOUT; Width: 0.098inch; Package Quantity: 1000; Height: 2.5mm; Dielectric Material: Ceramic; Voltage Rating: 50V; Series: C; Capacitance: 10uF; Tolerance: 20%; Weight: 0.000564oz; Case/Package: 1210; Case Code (Imperial): 1210; Dielectric: X7R; Case Code (Metric): 3225; REACH SVHC: No SVHC; Packaging: Tape and Reel; Length: 0.126inch; Termination: SMD/SMT; Min Operating Temperature: -55°C; Voltage Rating (DC): 50V; Lead Free: Lead Free; Max Operating Temperature: 125°C; Thickness: 0.11inch; Mount: Surface Mount
C79 = CMP-03422-000642-1: as C105 on sheet LM74910H_PINOUT; Automotive: Yes; ComponentLink2Description: Datasheet; Device Class L2: Capacitors; Height: 0.95mm; Manufacturer Part Number: AC1210KKX7R0BB104; Temperature: -55°C to +125°C; Voltage Rating: 100 V; Device Class L1: Passive Components; ComponentLink2URL: http://www.yageo.com/documents/recent/UPY-AC_NP0X7R_16V-to-630V_12.pdf; Lead Free: Yes; Category: Cap; Temperature Range High: +125°C; RoHS: TRUE; Digikey Description: CAP CER 0.1UF 100V X7R 1210; Temperature Range Low: -55°C; Octopart: https://octopart.com/ac1210kkx7r0bb104-yageo-78873719; Device Class L3: Ceramic Capacitors; Ipc Land Pattern Name: CAPC320250X85; Package: AC1210-0.85; Footprint Url: http://www.yageo.com/exep/pages/download/literatures/UPY-C_GEN_24.pdf; Temperature Characteristic: X7R
C80-C83 = CMP-2000-06362-2: DIFF P/N 100UF 6.3V GRM32EC80J107ME20L; Voltage: 16V; Tolerance: 10%; Capacitance: 47uF; Dielectric: X5R; Material: Ceramic; Case Code (Metric): 3225; RoHS Compliant: Yes; Min Operating Temperature: -55°C; Radiation Hardening: No; Package Quantity: 1; Case Code (Imperial): 1210; REACH SVHC: No SVHC; Voltage Rating (DC): 16V; Case/Package: 1210; Length: 3.2mm; Voltage Rating: 16V; Packaging: Cut Tape; Width: 0.098inch; Number of Pins: 2; Lead Free: Lead Free; Height: 2.5mm; Mount: Surface Mount; Termination: SMD/SMT; Max Operating Temperature: 85°C; Thickness: 0.106inch; Depth: 2.5mm
D1 = CMP-1060-00750-1: as D9 on sheet LM74910H_PINOUT; RoHS: Pb-Free; ComponentLink2Description: Datasheet; PackageReference: SOD-523-2-502-01; DatasheetVersion: Rev. 10; ComponentLink1Description: Manufacturer URL; PackageVersion: Rev. E, 09/2010; ComponentLink3URL: http://www.onsemi.com/pub_link/Collateral/502-01.PDF; ComponentLink2URL: http://www.onsemi.cn/pub_link/Collateral/MM5Z2V4T1-D.PDF; Mounting Technology: Surface Mount; PartNumber: MM5Z3V3T1G; Packing: Tape and Reel; PackageDescription: 2-Pin SOD, Body 1.2 x 0.8 mm; ComponentLink1URL: http://www.onsemi.com/; ComponentLink3Description: Package Specification
L13 = CMP-0226-00120-2: NexarPartId: 22803324; Self Resonant Frequency: 44MHz; DC Resistance (DCR): 5.2mΩ; Saturation Current: 22.4A; Inductance Tolerance: 20%; Material: Ferrite; Inductance: 3.3µH; Current Rating: 17A; Height: 9.5mm; Number of Pins: 2; Length: 12.1mm; Width: 11.4mm; Packaging: Tape & Reel (TR); Ambient Temperature Range High: 75°C; RoHS: Compliant; Max Operating Temperature: 125°C; Min Operating Temperature: -40°C; Ambient Temperature Range Low: -40°C; Core Material: Ferrite
R67 R70-R77 R79 R80 = CMP-009-00002-14: Resistor
  R72: Value: 100k
  R75: Value: 1k
R68 = CMP-00597-24927457-1: as R82 on sheet LM704A0_5V0_PINOUT; Length: 3.1mm; Composition: Metal Foil; Termination: SMD/SMT; Max Operating Temperature: 155°C; Case Code (Imperial): 2512; NexarPartId: 24927457; Width: 6.3mm; Max Power Dissipation: 3W; Case Code (Metric): 6432; Min Operating Temperature: -55°C; Packaging: Digi-Reel®; Max Thickness: 700µm; Lifecycle Status: Production; Height: 700µm; Weight: 40.511469mg; Case/Package: 2512; RoHS: Compliant; Number of Terminations: 2
R69 = CMP-009-00002-14: Resistor; Value: 100k
R78 = CMP-2000-00869-1: Manufacturer: Panasonic; Part Number: ERT-J1VR103J
U5 = CMP-019-00058-1: as U6 on sheet LM704A0_5V0_PINOUT; Case/Package: VQFN; Pins: 29

## Sheet STM32G473RET6_PINOUT.SchDoc
size C; SheetNumber: 14; SheetTotal: 19
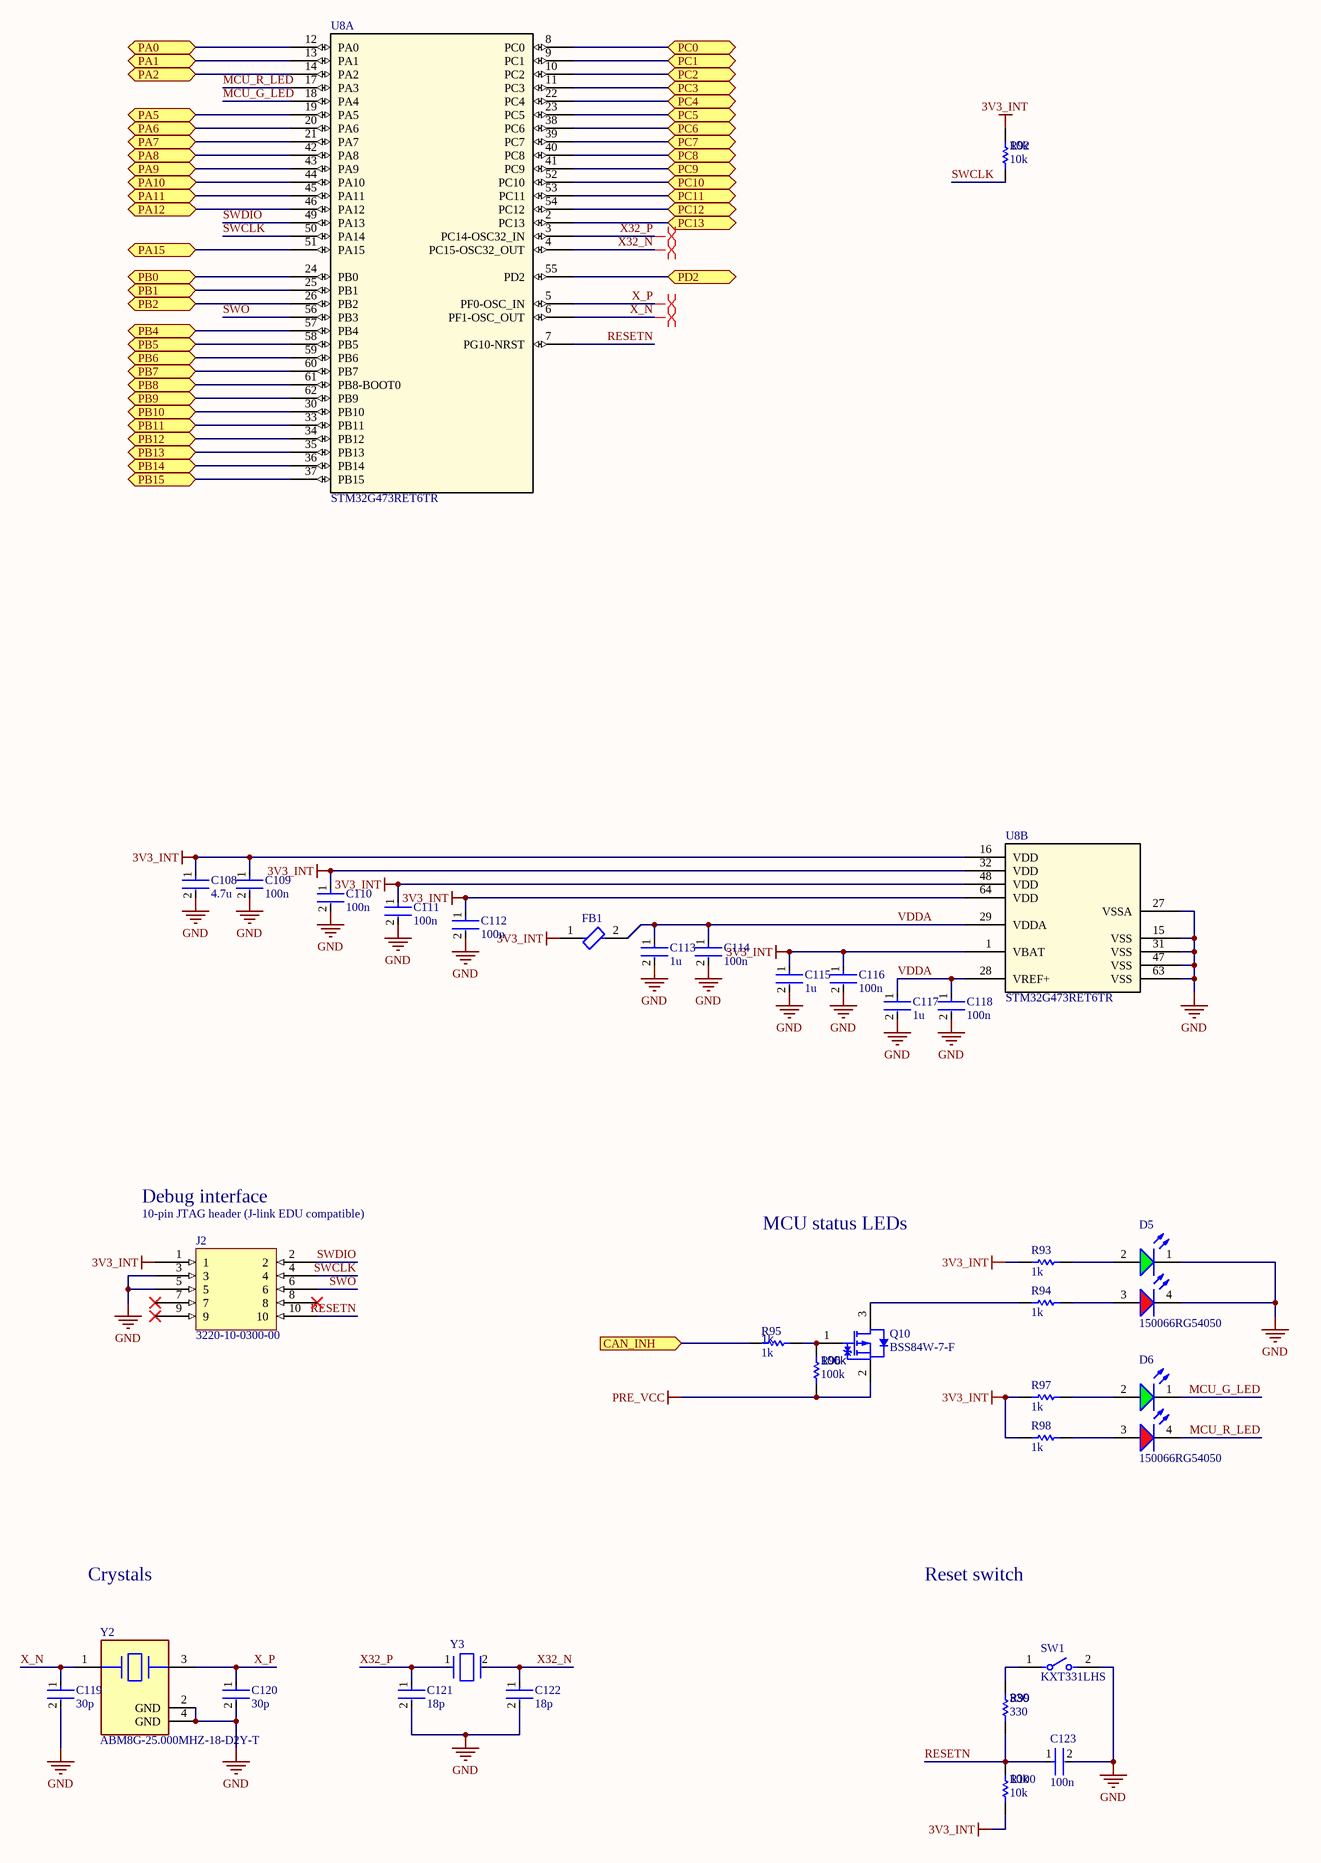
[diagram p29: STM32G473RET6_PINOUT.SchDoc]

### Parts
C108  4.7u  [FP-0402-L_1_0_0_05-W_0_5-IPC_A]
C109  100n  [FP-0402-L_1_0_0_05-W_0_5-IPC_A]
C110  100n  [FP-0402-L_1_0_0_05-W_0_5-IPC_A]
C111  100n  [FP-0402-L_1_0_0_05-W_0_5-IPC_A]
C112  100n  [FP-0402-L_1_0_0_05-W_0_5-IPC_A]
C113  1u  [FP-0402-L_1_0_0_05-W_0_5-IPC_A]
C114  100n  [FP-0402-L_1_0_0_05-W_0_5-IPC_A]
C115  1u  [FP-0402-L_1_0_0_05-W_0_5-IPC_A]
C116  100n  [FP-0402-L_1_0_0_05-W_0_5-IPC_A]
C117  1u  [FP-0402-L_1_0_0_05-W_0_5-IPC_A]
C118  100n  [FP-0402-L_1_0_0_05-W_0_5-IPC_A]
C119  30p  [FP-0402-L_1_0_0_05-W_0_5-IPC_A]
C120  30p  [FP-0402-L_1_0_0_05-W_0_5-IPC_A]
C121  18p  [FP-0402-L_1_0_0_05-W_0_5-IPC_A]
C122  18p  [FP-0402-L_1_0_0_05-W_0_5-IPC_A]
C123  100n  [FP-0402-L_1_0_0_05-W_0_5-IPC_A]
D5  150066RG54050  [WL-SBCD_0606]
D6  150066RG54050  [WL-SBCD_0606]
FB1  BLM15PX601SN1D  [FP-BLM15-0_05-MFG]  (value not drawn)
J2  3220-10-0300-00  [3220-10-0300-00-Footprint-1]
Q10  BSS84W-7-F  [DIOD-SOT323-3_V]
R92  10k  [R0603B]
R93  1k  [R0603B]
R94  1k  [R0603B]
R95  1k  [R0603B]
R96  100k  [R0603B]
R97  1k  [R0603B]
R98  1k  [R0603B]
R99  330  [R0603B]
R100  10k  [R0603B]
SW1  KXT331LHS  [FP-KXT331LHS-MFG]
U8  STM32G473RET6TR  [STM32G473RET6TR-Footprint-1]  (parts A,B of 2)
Y2  ABM8G-25.000MHZ-18-D2Y-T  [FP-ABM8G-MFG]
Y3  ECS-.327-12.5-1210-TR  [FP-ECX-1210-MFG]  (value not drawn)

### Ports
CAN_INH (in), PA0 (bidir), PA1 (bidir), PA2 (bidir), PA5 (bidir), PA6 (bidir), PA7 (bidir), PA8 (bidir), PA9 (bidir), PA10 (bidir), PA11 (bidir), PA12 (bidir), PA15 (bidir), PB0 (bidir), PB1 (bidir), PB2 (bidir), PB4 (bidir), PB5 (bidir), PB6 (bidir), PB7 (bidir), PB8 (bidir), PB9 (bidir), PB10 (bidir), PB11 (bidir), PB12 (bidir), PB13 (bidir), PB14 (bidir), PB15 (bidir), PC0 (bidir), PC1 (bidir), PC2 (bidir), PC3 (bidir), PC4 (bidir), PC5 (bidir), PC6 (bidir), PC7 (bidir), PC8 (bidir), PC9 (bidir), PC10 (bidir), PC11 (bidir), PC12 (bidir), PC13 (bidir), PD2 (bidir)

### Nets
3V3_INT: C108.1 C109.1 C110.1 C111.1 C112.1 C115.1 C116.1 FB1.1 J2.1 R92.2 R93.2 R97.2 R98.2 R100.1 U8.1(VBAT) U8.16(VDD) U8.32(VDD) U8.48(VDD) U8.64(VDD)
GND: C108.2 C109.2 C110.2 C111.2 C112.2 C113.2 C114.2 C115.2 C116.2 C117.2 C118.2 C119.2 C120.2 C121.2 C122.2 C123.2 D5.1(K) D5.4(K) J2.3 J2.5 SW1.2 U8.15(VSS) U8.27(VSSA) U8.31(VSS) U8.47(VSS) U8.63(VSS) Y2.2(GND) Y2.4(GND)
PRE_VCC: Q10.2(S) R96.2
MCU_G_LED: D6.1(K) U8.18(PA4)
MCU_R_LED: D6.4(K) U8.17(PA3)
RESETN: C123.1 J2.10 R99.1 R100.2 U8.7(PG10-NRST)
SWCLK: J2.4 R92.1 U8.50(PA14)
SWDIO: J2.2 U8.49(PA13)
SWO: J2.6 U8.56(PB3)
VDDA: C113.1 C114.1 C117.1 C118.1 FB1.2 U8.28(VREF+) U8.29(VDDA)
X32_N: C122.1 U8.4(PC15-OSC32_OUT) Y3.2(Out/In)
X32_P: C121.1 U8.3(PC14-OSC32_IN) Y3.1(In/Out)
X_N: C119.1 U8.6(PF1-OSC_OUT) Y2.1
X_P: C120.1 U8.5(PF0-OSC_IN) Y2.3
NetD5_2: D5.2(A) R93.1
NetD5_3: D5.3(A) R94.1
NetD6_2: D6.2(A) R97.1
NetD6_3: D6.3(A) R98.1
NetQ10_1: Q10.1(G) R95.1 R96.1
NetQ10_3: Q10.3(D) R94.2
NetR95_2: R95.2 ; port CAN_INH
NetR99_2: R99.2 SW1.1
NetU8_2: U8.2(PC13) ; port PC13
NetU8_8: U8.8(PC0) ; port PC0
NetU8_9: U8.9(PC1) ; port PC1
NetU8_10: U8.10(PC2) ; port PC2
NetU8_11: U8.11(PC3) ; port PC3
NetU8_12: U8.12(PA0) ; port PA0
NetU8_13: U8.13(PA1) ; port PA1
NetU8_14: U8.14(PA2) ; port PA2
NetU8_19: U8.19(PA5) ; port PA5
NetU8_20: U8.20(PA6) ; port PA6
NetU8_21: U8.21(PA7) ; port PA7
NetU8_22: U8.22(PC4) ; port PC4
NetU8_23: U8.23(PC5) ; port PC5
NetU8_24: U8.24(PB0) ; port PB0
NetU8_25: U8.25(PB1) ; port PB1
NetU8_26: U8.26(PB2) ; port PB2
NetU8_30: U8.30(PB10) ; port PB10
NetU8_33: U8.33(PB11) ; port PB11
NetU8_34: U8.34(PB12) ; port PB12
NetU8_35: U8.35(PB13) ; port PB13
NetU8_36: U8.36(PB14) ; port PB14
NetU8_37: U8.37(PB15) ; port PB15
NetU8_38: U8.38(PC6) ; port PC6
NetU8_39: U8.39(PC7) ; port PC7
NetU8_40: U8.40(PC8) ; port PC8
NetU8_41: U8.41(PC9) ; port PC9
NetU8_42: U8.42(PA8) ; port PA8
NetU8_43: U8.43(PA9) ; port PA9
NetU8_44: U8.44(PA10) ; port PA10
NetU8_45: U8.45(PA11) ; port PA11
NetU8_46: U8.46(PA12) ; port PA12
NetU8_51: U8.51(PA15) ; port PA15
NetU8_52: U8.52(PC10) ; port PC10
NetU8_53: U8.53(PC11) ; port PC11
NetU8_54: U8.54(PC12) ; port PC12
NetU8_55: U8.55(PD2) ; port PD2
NetU8_57: U8.57(PB4) ; port PB4
NetU8_58: U8.58(PB5) ; port PB5
NetU8_59: U8.59(PB6) ; port PB6
NetU8_60: U8.60(PB7) ; port PB7
NetU8_61: U8.61(PB8-BOOT0) ; port PB8
NetU8_62: U8.62(PB9) ; port PB9

Not connected (* = marked no-connect by the designer): J2 7* 8* 9*

### Layout directives
differential pair: X32_N, X32_P, X_N, X_P

### Notes on the sheet
- Debug interface
- (near J2) 10-pin JTAG header (J-link EDU compatible)
- MCU status LEDs
- Crystals
- Reset switch

### Library data of the parts
C108-C123 = CMP-001-00058-1: as C66 on sheet LM74910H_PINOUT; Min Operating Temperature: -55°C; Mounting Technology: Surface Mount; Pins: 2; Case/Package: 0402; RoHS Compliant: Yes; Max Operating Temperature: 85°C
  C108: Value: 4.7u
  C109-C112 C114 C116 C118 C123: Value: 100n
  C113 C115 C117: Value: 1u
  C119 C120: Value: 30p
  C121 C122: Value: 18p
D5 D6 = CMP-004-00040-2: Led, Red/Grn, 180Mcd/230Mcd, 624Nm/525Nm Rohs Compliant: Yes; Source: rgled.SchLib; Component Type: Standard; Design Item ID: CMP-004-00034-2; Pins: 4
FB1 = CMP-0686-00252-4: Chip Ferrite Bead, 0402, 600Ω @ 100MHz, 0.23Ω, 25%, 900mA; Number of Circuits: 1; Impedance: 600R; DC Resistance (DCR): 230mR; Material: Steel; Length: 1mm; Package Quantity: 10000; Height: 0.5mm; Width: 0.5mm; Max DC Current: 900mA; Number of Lines: 1; Termination: SMD/SMT; Packaging: Tape and Reel; Lead Free: Lead Free; Min Operating Temperature: -55°C; Max Operating Temperature: 125°C; Max Current Rating: 900mA; Case Code (Imperial): 0402; Number of Pins: 2; Current Rating: 900mA; Test Frequency: 100MHz; Case/Package: 0402; Tolerance: 25%; Case Code (Metric): 1005
J2 = CMP-001-0013-3: CONN HEADER SMD 10POS 1.27MM
Q10 = CMP-2000-06170-1: DIFF P/N!!! / P-Channel Enhancement Mode MOSFET, 310 mW, 20 V, -55 to 150 degC, 3-Pin SOT-323, RoHS, Tape and Reel; Manufacturer: Diodes Inc; Qg Gate Charge: 0.622nC; Drain-Source On Resistance-Max: 750mO; Rated Power Dissipation: 310mW; Drain-to-Source Voltage [Vdss]: 20V; Package Reference: SOT323; Datasheet Version: Rev. 3-2, 09/2013; Package Description: 3-Pin Small Outline Transistor, Body 2 x 1.25 mm, Pitch 0.65 mm; Mounting Technology: SurfaceMount; Manufacturer URL: http://www.diodes.com/; Datasheet URL: http://www.diodes.com/_files/datasheets/ds31861.pdf; Channel Type: P-Channel
R92-R100 = CMP-009-00002-14: Resistor
  R92 R100: Value: 10k
  R93-R95 R97 R98: Value: 1k
  R96: Value: 100k
  R99: Value: 330
SW1 = CMP-10040-000029-1: SWITCH TACTILE SPST-NO 0.02A 15V; Operating Force: 240gf; Switch Travel: 0.13mm; Illumination Type: Non-Illuminated; Throw Configuration: SPST; Number of Ports: 1; Current Rating: 5A; Mechanical Life: 500000Cycles; Switch Function: Off-Mom; Connector Type: USB; Actuator Type: Standard; Gender: Receptacle; Number of Contacts: 24; Contact Plating: Gold; Insulation Color: Black; Min Operating Temperature: -40°C; Packaging: Tape and Reel; Flammability Rating: UL94 V-0; Max Operating Temperature: 85°C; Termination: Solder; Mount: Surface Mount
U8 = CMP-020-00020-2: MCU 32-Bit STM32 ARM Cortex-M4 RISC 512KB Flash 1.71V to 3.6V 64-Pin LQFP T/R; RoHS Compliant: Yes
Y2 = CMP-2000-05733-3: Crystal 25MHz ±20ppm (Tol) ±30ppm (Stability) 18pF FUND 60Ω 4-Pin SMD T/R; Series Resistance: 60R; Length: 3.2mm; Depth: 2.5mm; Packaging: Tape and Reel; Min Operating Temperature: -40°C; Operating Frequency: 25 MHz; Lead Free: Lead Free; Number of Pins: 4; Frequency Tolerance: 20ppm; Radiation Hardening: No; Max Operating Temperature: 85°C; Termination: SMD/SMT; Frequency Stability: 30ppm; Frequency: 25MHz; Series: ABM8G; Mount: Surface Mount; Package Quantity: 1000; Height: 0.039inch; Width: 0.098inch; Case/Package: CSMD; ESR (Equivalent Series Resistance): 60R; Load Capacitance: 18pF; Tolerance: 20ppm
Y3 = CMP-40224-000006-1: CRYSTAL 32.7680KHZ 12.5PF SMD; Manufacturer: ECS International; Frequency: 32.768kHz; Esr: 90kΩ; Tolerance: 20ppm; Device Class L1: Passive Components; Load Capacitance: 12.5pF; Temperature: -40°C to +85°C; ComponentLink2URL: https://ecsxtal.com/store/pdf/ECX-1210.pdf; Series: ECX-1210; Octopart: https://octopart.com/ecs-.327-12.5-1210-tr-ecs+international-81221340; ComponentLink2Description: Datasheet; Temperature Range Low: -40°C; Digikey Description: CRYSTAL 32.7680KHZ 12.5PF SMD; Lead Free: Yes; RoHS: TRUE; Device Class L3: Crystals; Automotive: No; Category: Crys; Height: 0.5mm; Manufacturer Part Number: ECS-.327-12.5-1210-TR; Temperature Range High: +85°C; Device Class L2: Crystals / Oscillators; Package: ECX-1210

## Nets that join several sheets
3V3_INT: DES_0 (6 pins), DES_1 (6 pins), OR_0 (R58_OR_0.2), OR_1 (R58_OR_1.2), LM704A0_5V0_PINOUT (R17.1 R85.2), LM704A0_3V3_PINOUT (R73.2 R75.1), STM32G473RET6_PINOUT (19 pins)
3V3_M2_NVME: ADAS_ECU_revB (F?#9.2), M2_NVME (19 pins)
3V3_M2_WIFI: ADAS_ECU_revB (F?#10.2), M2_WIFI (14 pins)
3V3_MAIN: ADAS_ECU_revB (7 pins), RAIL_DISCH_2 (R44_RAIL_DISCH_2.1), LM704A0_3V3_PINOUT (9 pins)
3V3_SER_0: ADAS_ECU_revB (F?#14.2), MAX96751_PINOUT (19 pins)
5V0_MAIN: ADAS_ECU_revB (F?#6.1 F?#7.1 F?#8.1), RAIL_DISCH_1 (R44_RAIL_DISCH_1.1), LM704A0_5V0_PINOUT (13 pins)
12V0_MAIN: ADAS_ECU_revB (5 pins), RAIL_DISCH_0 (R44_RAIL_DISCH_0.1)
12V0_PoC_0: ADAS_ECU_revB (F?#1.2), DES_0 (F1_DES_0.1 F2_DES_0.1 F3_DES_0.1 F4_DES_0.1)
12V0_PoC_1: ADAS_ECU_revB (F?#2.2), DES_1 (F1_DES_1.1 F2_DES_1.1 F3_DES_1.1 F4_DES_1.1)
APM_VCC: ADAS_ECU_revB (6 pins), OR_1 (6 pins)
CAR_VCC: ADAS_ECU_revB (6 pins), OR_0 (6 pins)
GND: ADAS_ECU_revB (19 pins), DES_0 (61 pins), DES_1 (61 pins), STP_MAX96724_PINOUT (36 pins), MAX96751_PINOUT (30 pins), M2_NVME (30 pins), M2_WIFI (29 pins), RAIL_DISCH_0 (5 pins), RAIL_DISCH_1 (5 pins), RAIL_DISCH_2 (5 pins), OR_0 (21 pins), OR_1 (21 pins), LM704A0_5V0_PINOUT (30 pins), LM704A0_3V3_PINOUT (27 pins), STM32G473RET6_PINOUT (28 pins)
JSN_1V8_REF: DES_0 (Q4_DES_0.1 R24_DES_0.2), DES_1 (Q4_DES_1.1 R24_DES_1.2), STP_MAX96724_PINOUT (Q4.1 R24.2), MAX96751_PINOUT (Q31.1 R217.2), M2_WIFI (C190.1 U21.5)
MAX96724_3V3: ADAS_ECU_revB (F?#11.2), DES_0 (11 pins)
MAX96724_3V3: ADAS_ECU_revB (F?#12.2), DES_1 (11 pins)
MAX96724_3V3: ADAS_ECU_revB (F?#13.2), STP_MAX96724_PINOUT (11 pins)
PRE_VCC: RAIL_DISCH_0 (R45_RAIL_DISCH_0.2), RAIL_DISCH_1 (R45_RAIL_DISCH_1.2), RAIL_DISCH_2 (R45_RAIL_DISCH_2.2), OR_0 (6 pins), OR_1 (6 pins), STM32G473RET6_PINOUT (Q10.2 R96.2)
3V3_3V3_MAIN_ENABLE: RAIL_DISCH_2 (R47_RAIL_DISCH_2.2), LM704A0_3V3_PINOUT (R70.2)
3V3_5V0_MAIN_ENABLE: RAIL_DISCH_1 (R47_RAIL_DISCH_1.2), LM704A0_5V0_PINOUT (R83.2)
3V3_MAX96724_I_SNS_SCL: DES_0 (U4_DES_0.4), DES_1 (U4_DES_1.4)
3V3_MAX96724_I_SNS_SDA: DES_0 (U4_DES_0.5), DES_1 (U4_DES_1.5)
3V3_PCIE0_nWAKE: M2_NVME (J13.52), M2_WIFI (R?#25.2)
HV_PWR_EN: OR_0 (U12_OR_0.7), OR_1 (U12_OR_1.7)
MAX96724_PoC_A: ADAS_ECU_revB (J?#4.2), DES_0 (C1_DES_0.2 L3_DES_0.2)
MAX96724_PoC_A: ADAS_ECU_revB (J?#5.2), DES_1 (C1_DES_1.2 L3_DES_1.2)
MAX96724_PoC_B: ADAS_ECU_revB (J?#4.1), DES_0 (C9_DES_0.2 L6_DES_0.2)
MAX96724_PoC_B: ADAS_ECU_revB (J?#5.1), DES_1 (C9_DES_1.2 L6_DES_1.2)
MAX96724_PoC_C: ADAS_ECU_revB (J?#4.4), DES_0 (C19_DES_0.2 L9_DES_0.2)
MAX96724_PoC_C: ADAS_ECU_revB (J?#5.4), DES_1 (C19_DES_1.2 L9_DES_1.2)
MAX96724_PoC_D: ADAS_ECU_revB (J?#4.3), DES_0 (C25_DES_0.2 L12_DES_0.2)
MAX96724_PoC_D: ADAS_ECU_revB (J?#5.3), DES_1 (C25_DES_1.2 L12_DES_1.2)
MAX96751_CLK_N: ADAS_ECU_revB (R?#8.2), MAX96751_PINOUT (U22.45)
MAX96751_CLK_P: ADAS_ECU_revB (R?#7.2), MAX96751_PINOUT (U22.46)
MAX96751_RX0_N: ADAS_ECU_revB (R?#2.2), MAX96751_PINOUT (U22.48)
MAX96751_RX0_P: ADAS_ECU_revB (R?#1.2), MAX96751_PINOUT (U22.49)
MAX96751_RX1_N: ADAS_ECU_revB (R?#4.2), MAX96751_PINOUT (U22.50)
MAX96751_RX1_P: ADAS_ECU_revB (R?#3.2), MAX96751_PINOUT (U22.51)
MAX96751_RX2_N: ADAS_ECU_revB (R?#6.2), MAX96751_PINOUT (U22.52)
MAX96751_RX2_P: ADAS_ECU_revB (R?#5.2), MAX96751_PINOUT (U22.53)
NetQ30_3: ADAS_ECU_revB (R?#11.2), MAX96751_PINOUT (Q30.3 R215.1)
NetQ30_6: ADAS_ECU_revB (R?#9.2), MAX96751_PINOUT (Q30.6 R213.1)
NetR207_2: ADAS_ECU_revB (R?#15.2), MAX96751_PINOUT (R207.2)
NetR209_2: ADAS_ECU_revB (R?#13.2), MAX96751_PINOUT (R209.2)
RF_MAX96751_0_A_N: ADAS_ECU_revB (J?#6.3), MAX96751_PINOUT (C204.2 R205.1)
RF_MAX96751_0_A_P: ADAS_ECU_revB (J?#6.1), MAX96751_PINOUT (C201.2 R204.1)
RF_MAX96751_0_B_N: ADAS_ECU_revB (J?#7.3), MAX96751_PINOUT (C208.2 R208.1)
RF_MAX96751_0_B_P: ADAS_ECU_revB (J?#7.1), MAX96751_PINOUT (C207.2 R206.1)